# EAGLE board axiom_beta_sensor_cmv12000_tht_v0.16_r1.5c_jlcpcb (EAGLE 7.7.0), part 1 of 2
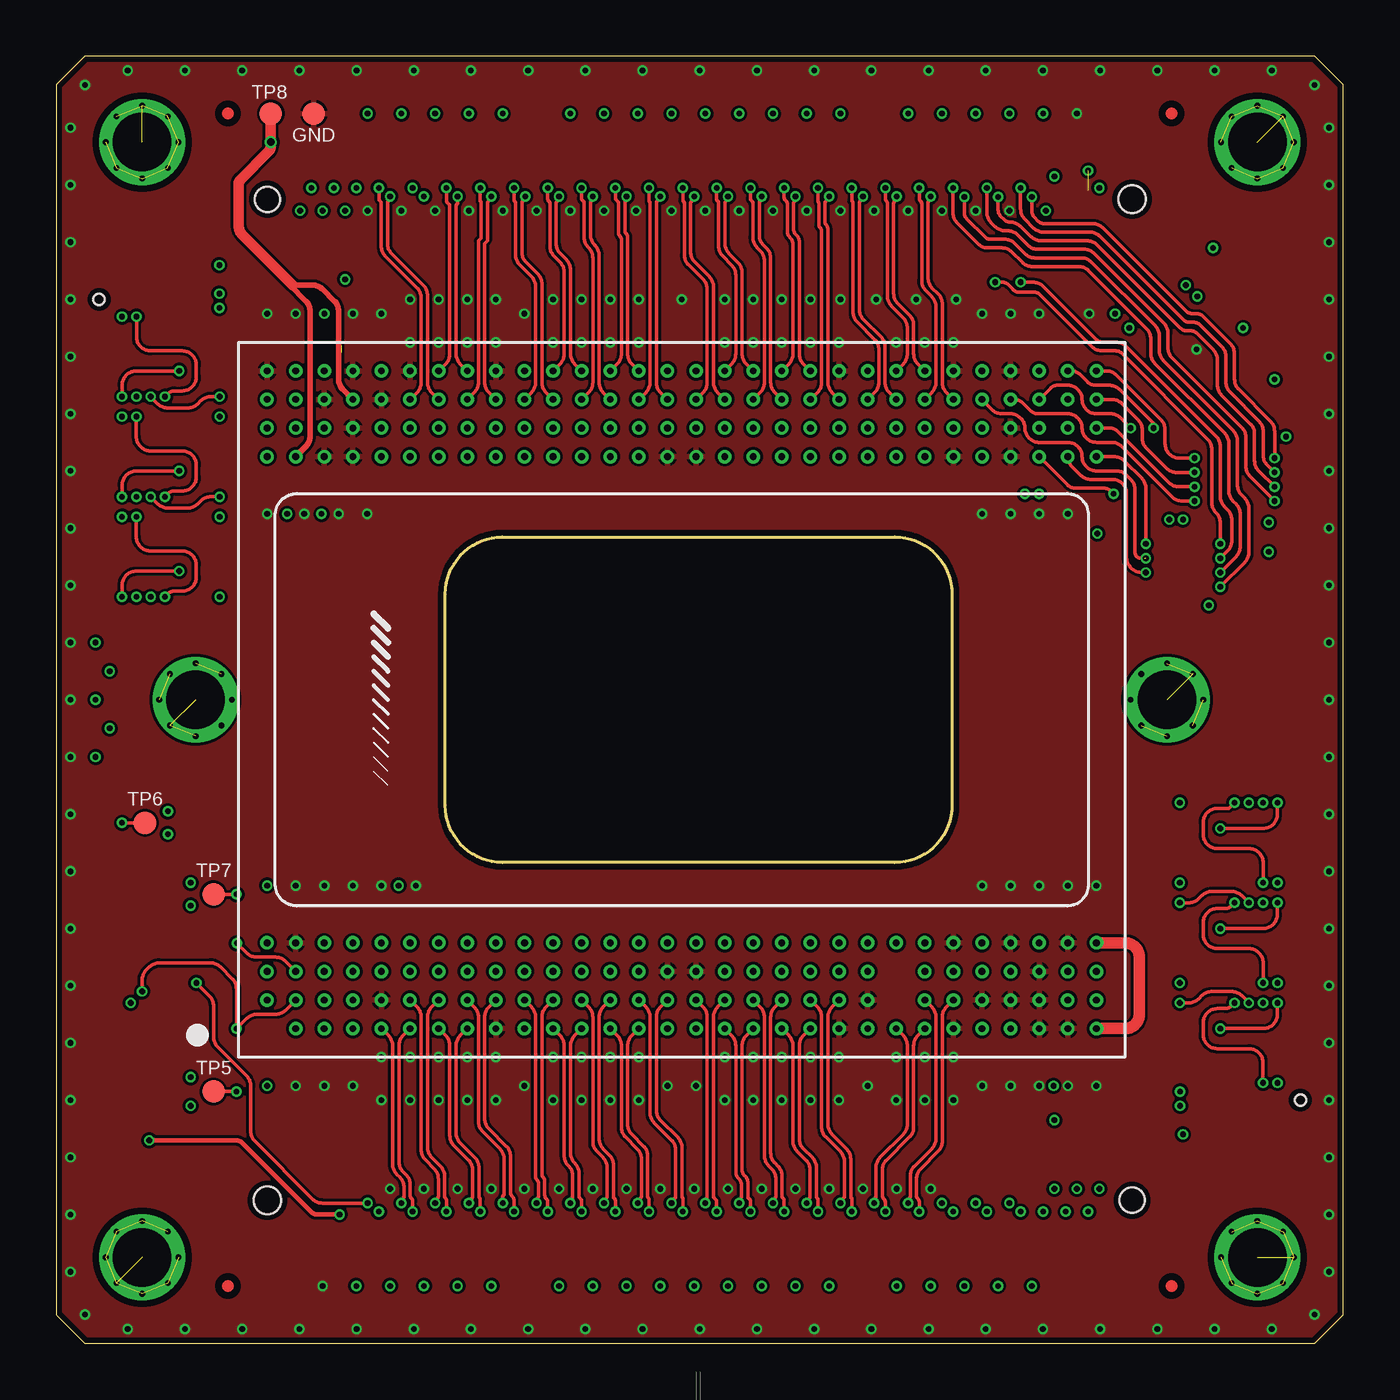
[diagram p5: board, top side]
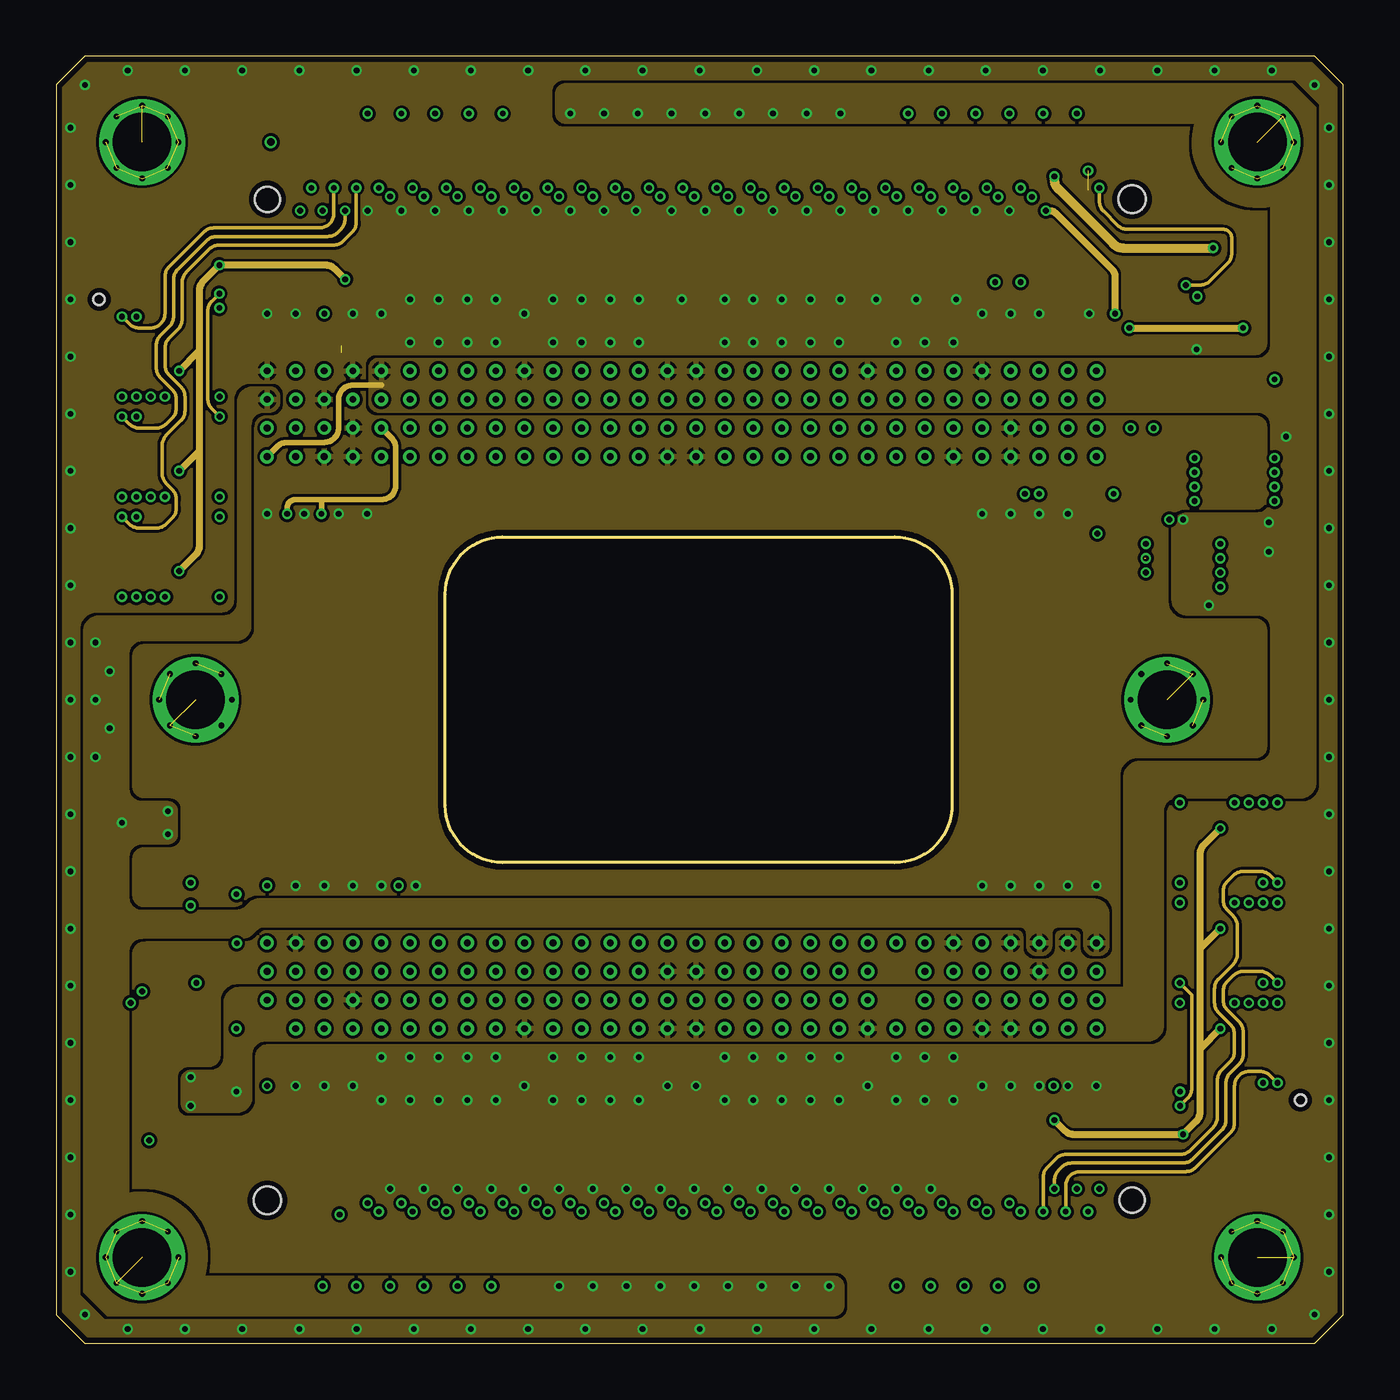
[diagram p6: board, inner layer Route2]
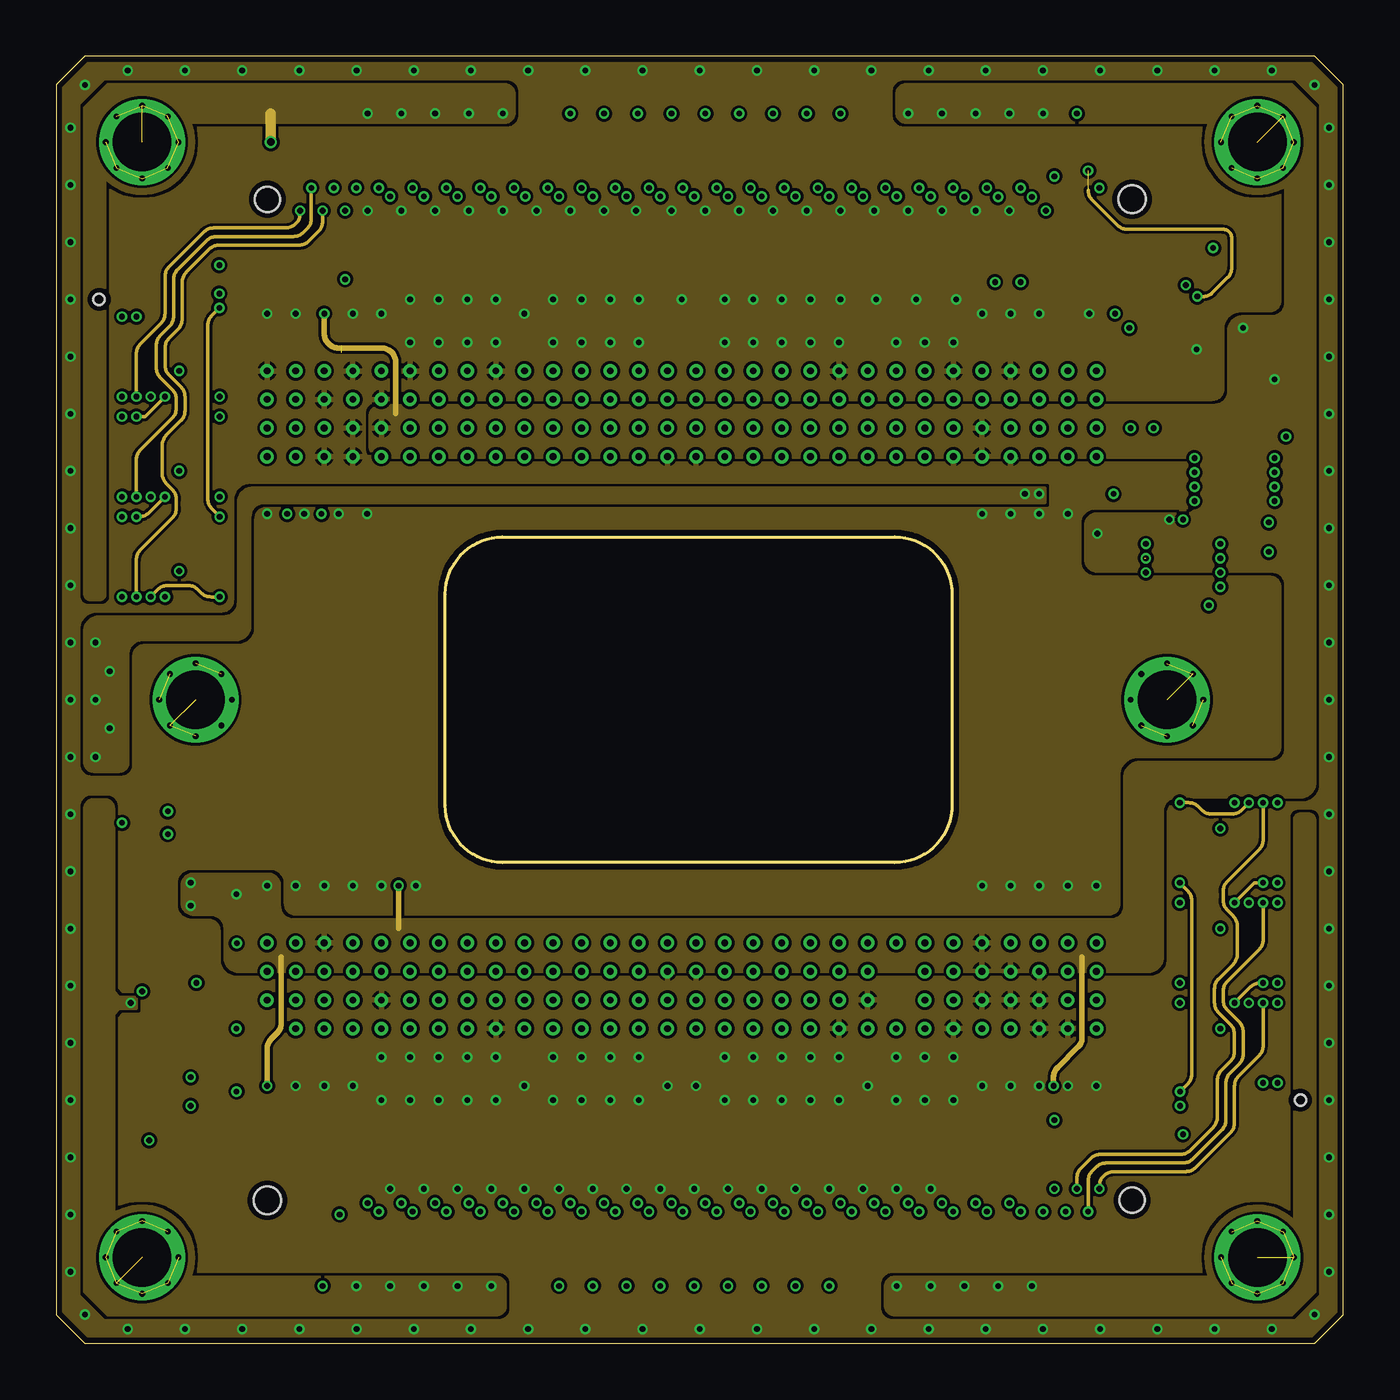
[diagram p7: board, inner layer Route15]
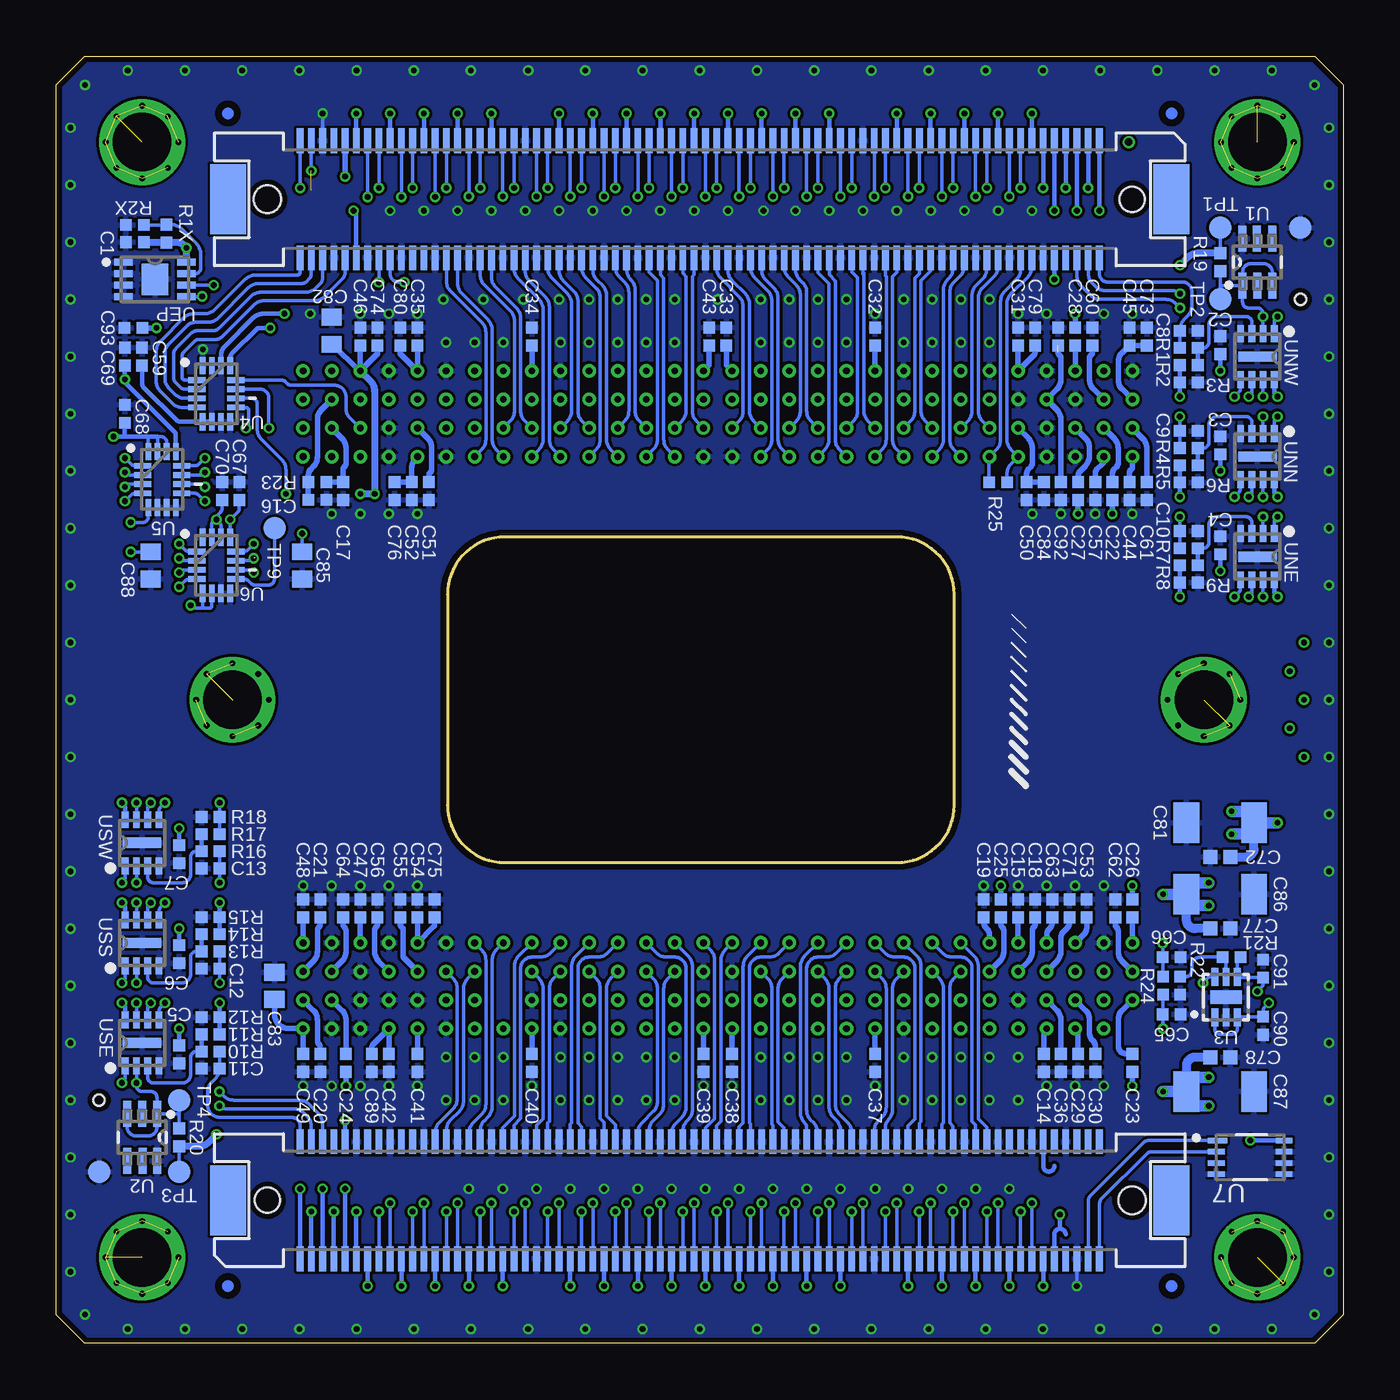
[diagram p8: board, bottom side, seen from below]

Size 57.15 x 57.15 mm. Coordinates in mm from the lower left corner, seen from the top.
Outline: 55.88,57.15 1.27,57.15 0,55.88 0,1.27 1.27,0 55.88,0 57.15,1.27 57.15,55.88 55.88,57.15
Outline: 37.23,21.34 19.81,21.34 arc-90 17.27,23.88 17.27,33.27 arc-90 19.81,35.8 37.23,35.8 arc-90 39.77,33.27 39.77,23.88 arc-90 37.23,21.34
Copper layers (1*2*15*16): Top 0.035559375mm / dielectric 0.17018125mm / Route2 0.01778125mm / dielectric 47mil / Route15 0.01778125mm / dielectric 0.17018125mm / Bottom 0.035559375mm
Design rules "axiom_beta_interface_OSHPark-4layer-tuned *": minimum track width 5mil, minimum drill 10mil, track to track 5mil, track to pad 5mil, pad to pad 5mil, via to via 5mil, smd to smd 5mil, copper to edge 10mil, drill to drill 6mil, minimum pad ring 4mil, minimum via ring 4mil, stop-mask expansion 2mil, vias tented up to drill 15mil, thermal gap 5mil
Net classes: 0 default: width 0.152 mm, drill 0.254 mm; 1 power: width 0.152 mm, drill 0.254 mm
Holes 0.5 mm at 55.25,10.79 1.9,46.36
bKeepout: area 1.4,24.8 to 13.4,32.4; area 43.9,24.8 to 56,32.4; area 50.8,50.8 to 55.9,55.9; area 50.8,1.3 to 55.9,6.3; area 1.3,1.3 to 6.3,6.3; area 1.3,50.8 to 6.3,55.9
tRestrict: area 51.1,1.6 to 55.5,6; area 1.6,51.1 to 6,55.5; area 51.1,51.1 to 55.5,55.5; area 1.6,1.6 to 6,6
bRestrict: area 48.9,41.7 to 49.5,41.8; area 48.9,42.1 to 49.5,42.2; area 54.4,43 to 54.5,44.1; area 53.7,43 to 53.8,44.1

## Footprints (pad centres in the part's own frame; a part is rotated, then mirrored left to right if it is on the bottom)
0402-C = smd 0.52 x 0.52: 1 -0.4,0; 2 0.4,0
0402-B = smd 0.62 x 0.62: 1 -0.45,0; 2 0.45,0
1206-B = smd 1.15 x 1.8: 1 -1.5,0; 2 1.5,0
0603-C = smd 0.75 x 0.9: 1 -0.6,0; 2 0.6,0
TP10R = smd 1 x 1: TP 0,0
10-30-07-237-400T4-JLCPCB = drill 0.3 pad 0.6: A2 -17.945,-14.605; A3 -16.675,-14.605; A4 -15.405,-14.605; A5 -14.135,-14.605; A6 -12.865,-14.605; A7 -11.595,-14.605; A8 -10.325,-14.605; A9 -9.055,-14.605; A10 -7.785,-14.605; A11 -6.515,-14.605; A12 -5.245,-14.605; A13 -3.975,-14.605; A14 -2.705,-14.605; A15 -1.435,-14.605; A16 -0.165,-14.605; A17 1.105,-14.605; A18 2.375,-14.605; A19 3.645,-14.605; A20 4.915,-14.605; A21 6.185,-14.605; A22 7.455,-14.605; A23 8.725,-14.605; A24 9.995,-14.605; A25 11.265,-14.605; A26 12.535,-14.605; A27 13.805,-14.605; A28 15.075,-14.605; A29 16.345,-14.605; A30 17.615,-14.605; B1 -19.215,-13.335; B2 -17.945,-13.335; B3 -16.675,-13.335; B4 -15.405,-13.335; B5 -14.135,-13.335; B6 -12.865,-13.335; B7 -11.595,-13.335; B8 -10.325,-13.335; B9 -9.055,-13.335; B10 -7.785,-13.335; B11 -6.515,-13.335; B12 -5.245,-13.335; B13 -3.975,-13.335; B14 -2.705,-13.335; B15 -1.435,-13.335; B16 -0.165,-13.335; B17 1.105,-13.335; B18 2.375,-13.335; B19 3.645,-13.335; B20 4.915,-13.335; B21 6.185,-13.335; B22 7.455,-13.335; B24 9.995,-13.335; B25 11.265,-13.335; B26 12.535,-13.335; B27 13.805,-13.335; B28 15.075,-13.335; B29 16.345,-13.335; B30 17.615,-13.335; C1 -19.215,-12.065; C2 -17.945,-12.065; C3 -16.675,-12.065; C4 -15.405,-12.065; C5 -14.135,-12.065; C6 -12.865,-12.065; C7 -11.595,-12.065; C8 -10.325,-12.065; C9 -9.055,-12.065; C10 -7.785,-12.065; C11 -6.515,-12.065; C12 -5.245,-12.065; C13 -3.975,-12.065; C14 -2.705,-12.065; C15 -1.435,-12.065; C16 -0.165,-12.065; C17 1.105,-12.065; C18 2.375,-12.065; C19 3.645,-12.065; C20 4.915,-12.065; C21 6.185,-12.065; C22 7.455,-12.065; C24 9.995,-12.065; C25 11.265,-12.065; C26 12.535,-12.065; C27 13.805,-12.065; C28 15.075,-12.065; C29 16.345,-12.065; C30 17.615,-12.065; D1 -19.215,-10.795; D2 -17.945,-10.795; D3 -16.675,-10.795; D4 -15.405,-10.795; D5 -14.135,-10.795; D6 -12.865,-10.795; D7 -11.595,-10.795; D8 -10.325,-10.795; D9 -9.055,-10.795; D10 -7.785,-10.795; D11 -6.515,-10.795; D12 -5.245,-10.795; D13 -3.975,-10.795; D14 -2.705,-10.795; D15 -1.435,-10.795; D16 -0.165,-10.795; D17 1.105,-10.795; D18 2.375,-10.795; D19 3.645,-10.795; D20 4.915,-10.795; D21 6.185,-10.795; D22 7.455,-10.795; D23 8.725,-10.795; D24 9.995,-10.795; D25 11.265,-10.795; D26 12.535,-10.795; D27 13.805,-10.795; D28 15.075,-10.795; D29 16.345,-10.795; D30 17.615,-10.795; E1 -19.215,10.795; E2 -17.945,10.795; E3 -16.675,10.795; E4 -15.405,10.795; E5 -14.135,10.795; E6 -12.865,10.795; E7 -11.595,10.795; E8 -10.325,10.795; E9 -9.055,10.795; E10 -7.785,10.795; E11 -6.515,10.795; E12 -5.245,10.795; E13 -3.975,10.795; E14 -2.705,10.795; E15 -1.435,10.795; E16 -0.165,10.795; E17 1.105,10.795; E18 2.375,10.795; E19 3.645,10.795; E20 4.915,10.795; E21 6.185,10.795; E22 7.455,10.795; E23 8.725,10.795; E24 9.995,10.795; E25 11.265,10.795; E26 12.535,10.795; E27 13.805,10.795; E28 15.075,10.795; E29 16.345,10.795; E30 17.615,10.795; F1 -19.215,12.065; F2 -17.945,12.065; F3 -16.675,12.065; F4 -15.405,12.065; F5 -14.135,12.065; F6 -12.865,12.065; F7 -11.595,12.065; F8 -10.325,12.065; F9 -9.055,12.065; F10 -7.785,12.065; F11 -6.515,12.065; F12 -5.245,12.065; F13 -3.975,12.065; F14 -2.705,12.065; F15 -1.435,12.065; F16 -0.165,12.065; F17 1.105,12.065; F18 2.375,12.065; F19 3.645,12.065; F20 4.915,12.065; F21 6.185,12.065; F22 7.455,12.065; F23 8.725,12.065; F24 9.995,12.065; F25 11.265,12.065; F26 12.535,12.065; F27 13.805,12.065; F28 15.075,12.065; F29 16.345,12.065; F30 17.615,12.065; G1 -19.215,13.335; G2 -17.945,13.335; G3 -16.675,13.335; G4 -15.405,13.335; G5 -14.135,13.335; G6 -12.865,13.335; G7 -11.595,13.335; G8 -10.325,13.335; G9 -9.055,13.335; G10 -7.785,13.335; G11 -6.515,13.335; G12 -5.245,13.335; G13 -3.975,13.335; G14 -2.705,13.335; G15 -1.435,13.335; G16 -0.165,13.335; G17 1.105,13.335; G18 2.375,13.335; G19 3.645,13.335; G20 4.915,13.335; G21 6.185,13.335; G22 7.455,13.335; G23 8.725,13.335; G24 9.995,13.335; G25 11.265,13.335; G26 12.535,13.335; G27 13.805,13.335; G28 15.075,13.335; G29 16.345,13.335; G30 17.615,13.335; H1 -19.215,14.605; H2 -17.945,14.605; H3 -16.675,14.605; H4 -15.405,14.605; H5 -14.135,14.605; H6 -12.865,14.605; H7 -11.595,14.605; H8 -10.325,14.605; H9 -9.055,14.605; H10 -7.785,14.605; H11 -6.515,14.605; H12 -5.245,14.605; H13 -3.975,14.605; H14 -2.705,14.605; H15 -1.435,14.605; H16 -0.165,14.605; H17 1.105,14.605; H18 2.375,14.605; H19 3.645,14.605; H20 4.915,14.605; H21 6.185,14.605; H22 7.455,14.605; H23 8.725,14.605; H24 9.995,14.605; H25 11.265,14.605; H26 12.535,14.605; H27 13.805,14.605; H28 15.075,14.605; H29 16.345,14.605; H30 17.615,14.605
SOT65P210X110-6N = smd 1.168 x 0.356: 1 -1.041,0.66; 2 -1.041,0; 3 -1.041,-0.66; 4 1.041,-0.66; 5 1.041,0.025; 6 1.041,0.66
MLF-6 = smd 0.3 x 0.8: 1 -0.5,-0.9; 2 0,-0.9; 3 0.5,-0.9; 4 0.5,0.9; 5 0,0.9; 6 -0.5,0.9 | smd 1.4 x 0.6: EP 0,0
QFN40P185X265X55-16N = smd 0.762 x 0.254: 1 -0.864,0.61; 2 -0.864,0.203; 3 -0.864,-0.203; 4 -0.864,-0.61; 9 0.864,-0.61; 10 0.864,-0.203; 11 0.864,0.203; 12 0.864,0.61 | smd 0.254 x 0.762: 5 -0.61,-1.245; 6 -0.203,-1.245; 7 0.203,-1.245; 8 0.61,-1.245; 13 0.61,1.245; 14 0.203,1.245; 15 -0.203,1.245; 16 -0.61,1.245
SOT996-2/3 = smd 0.25 x 0.85: 1 -0.75,-1.45 | smd 0.25 x 0.75: 2 -0.25,-1.5; 3 0.25,-1.5; 4 0.75,-1.5; 5 0.75,1.5; 6 0.25,1.5; 7 -0.25,1.5; 8 -0.75,1.5
DFN200X300X100-9N = smd 0.813 x 0.305: 1 -1.397,0.762; 2 -1.397,0.254; 3 -1.397,-0.254; 4 -1.397,-0.762; 5 1.397,-0.762; 6 1.397,-0.254; 7 1.397,0.254; 8 1.397,0.762 | smd 1.194 x 1.397: EP 0,0
DFN200X200X100-9N = smd 0.75 x 0.3: 1 -1.025,0.75; 2 -1.025,0.25; 3 -1.025,-0.25; 4 -1.025,-0.75; 5 1.025,-0.75; 6 1.025,-0.25; 7 1.025,0.25; 8 1.025,0.75 | smd 0.45 x 1.7: EP 0,0
FX10A-144P = smd 0.3 x 1.1: 1 -17.75,-2.6; 2 -17.75,2.6; 3 -17.25,-2.6; 4 -17.25,2.6; 5 -16.75,-2.6; 6 -16.75,2.6; 7 -16.25,-2.6; 8 -16.25,2.6; 9 -15.75,-2.6; 10 -15.75,2.6; 11 -15.25,-2.6; 12 -15.25,2.6; 13 -14.75,-2.6; 14 -14.75,2.6; 15 -14.25,-2.6; 16 -14.25,2.6; 17 -13.75,-2.6; 18 -13.75,2.6; 19 -13.25,-2.6; 20 -13.25,2.6; 21 -12.75,-2.6; 22 -12.75,2.6; 23 -12.25,-2.6; 24 -12.25,2.6; 25 -11.75,-2.6; 26 -11.75,2.6; 27 -11.25,-2.6; 28 -11.25,2.6; 29 -10.75,-2.6; 30 -10.75,2.6; 31 -10.25,-2.6; 32 -10.25,2.6; 33 -9.75,-2.6; 34 -9.75,2.6; 35 -9.25,-2.6; 36 -9.25,2.6; 37 -8.75,-2.6; 38 -8.75,2.6; 39 -8.25,-2.6; 40 -8.25,2.6; 41 -7.75,-2.6; 42 -7.75,2.6; 43 -7.25,-2.6; 44 -7.25,2.6; 45 -6.75,-2.6; 46 -6.75,2.6; 47 -6.25,-2.6; 48 -6.25,2.6; 49 -5.75,-2.6; 50 -5.75,2.6; 51 -5.25,-2.6; 52 -5.25,2.6; 53 -4.75,-2.6; 54 -4.75,2.6; 55 -4.25,-2.6; 56 -4.25,2.6; 57 -3.75,-2.6; 58 -3.75,2.6; 59 -3.25,-2.6; 60 -3.25,2.6; 61 -2.75,-2.6; 62 -2.75,2.6; 63 -2.25,-2.6; 64 -2.25,2.6; 65 -1.75,-2.6; 66 -1.75,2.6; 67 -1.25,-2.6; 68 -1.25,2.6; 69 -0.75,-2.6; 70 -0.75,2.6; 71 -0.25,-2.6; 72 -0.25,2.6; 73 0.25,-2.6; 74 0.25,2.6; 75 0.75,-2.6; 76 0.75,2.6; 77 1.25,-2.6; 78 1.25,2.6; 79 1.75,-2.6; 80 1.75,2.6; 81 2.25,-2.6; 82 2.25,2.6; 83 2.75,-2.6; 84 2.75,2.6; 85 3.25,-2.6; 86 3.25,2.6; 87 3.75,-2.6; 88 3.75,2.6; 89 4.25,-2.6; 90 4.25,2.6; 91 4.75,-2.6; 92 4.75,2.6; 93 5.25,-2.6; 94 5.25,2.6; 95 5.75,-2.6; 96 5.75,2.6; 97 6.25,-2.6; 98 6.25,2.6; 99 6.75,-2.6; 100 6.75,2.6; 101 7.25,-2.6; 102 7.25,2.6; 103 7.75,-2.6; 104 7.75,2.6; 105 8.25,-2.6; 106 8.25,2.6; 107 8.75,-2.6; 108 8.75,2.6; 109 9.25,-2.6; 110 9.25,2.6; 111 9.75,-2.6; 112 9.75,2.6; 113 10.25,-2.6; 114 10.25,2.6; 115 10.75,-2.6; 116 10.75,2.6; 117 11.25,-2.6; 118 11.25,2.6; 119 11.75,-2.6; 120 11.75,2.6; 121 12.25,-2.6; 122 12.25,2.6; 123 12.75,-2.6; 124 12.75,2.6; 125 13.25,-2.6; 126 13.25,2.6; 127 13.75,-2.6; 128 13.75,2.6; 129 14.25,-2.6; 130 14.25,2.6; 131 14.75,-2.6; 132 14.75,2.6; 133 15.25,-2.6; 134 15.25,2.6; 135 15.75,-2.6; 136 15.75,2.6; 137 16.25,-2.6; 138 16.25,2.6; 139 16.75,-2.6; 140 16.75,2.6; 141 17.25,-2.6; 142 17.25,2.6; 143 17.75,-2.6; 144 17.75,2.6 | smd 1.6 x 3.1: M1 -20.95,0; M2 20.95,0 | hole 1.125: -19.2,0 | hole 1.225: 19.2,0

## Placement (x,y rotation side)
C1  100n  [0402-C]  53.66,48.89 180 bottom
C2  100n  [0402-C]  5.46,44.32 90 bottom
C3  100n  [0402-C]  5.46,39.88 90 bottom
C4  100n  [0402-C]  5.46,35.43 90 bottom
C5  100n  [0402-C]  51.69,12.83 270 bottom
C6  100n  [0402-C]  51.69,17.27 270 bottom
C7  100n  [0402-C]  51.69,21.72 270 bottom
C8  1µ  [0402-C]  6.86,44.96 0 bottom
C9  1µ  [0402-C]  6.86,40.51 0 bottom
C10  1µ  [0402-C]  6.86,36.07 0 bottom
C11  1µ  [0402-C]  50.29,12.19 180 bottom
C12  1µ  [0402-C]  50.29,16.64 180 bottom
C13  1µ  [0402-C]  50.29,21.08 180 bottom
C14  100n  [0402-C]  13.3,12.45 270 bottom
C15  100n  [0402-C]  14.44,19.3 90 bottom
C16  100n  [0402-C]  45.55,37.45 0 bottom
C17  100n  [0402-C]  44.41,37.85 270 bottom
C18  100n  [0402-C]  13.68,19.3 90 bottom
C19  100n  [0402-C]  15.96,19.3 90 bottom
C20  100n  [0402-C]  45.43,12.45 270 bottom
C21  100n  [0402-C]  45.43,19.3 90 bottom
C22  100n  [0402-C]  10.25,37.85 90 bottom
C23  100n  [0402-C]  9.36,12.45 90 bottom
C24  100n  [0402-C]  44.28,12.45 90 bottom
C25  100n  [0402-C]  15.2,19.3 270 bottom
C26  100n  [0402-C]  9.36,19.3 270 bottom
C27  100n  [0402-C]  11.77,37.85 90 bottom
C28  100n  [0402-C]  11.9,44.7 270 bottom
C29  100n  [0402-C]  11.77,12.45 270 bottom
C30  100n  [0402-C]  11.01,12.45 270 bottom
C31  100n  [0402-C]  14.44,44.7 90 bottom
C32  100n  [0402-C]  20.79,44.7 90 bottom
C33  100n  [0402-C]  27.39,44.7 90 bottom
C34  100n  [0402-C]  36.03,44.7 90 bottom
C35  100n  [0402-C]  41.11,44.7 90 bottom
C36  100n  [0402-C]  12.54,12.45 270 bottom
C37  100n  [0402-C]  20.79,12.45 270 bottom
C38  100n  [0402-C]  27.14,12.45 270 bottom
C39  100n  [0402-C]  28.41,12.45 270 bottom
C40  100n  [0402-C]  36.03,12.45 270 bottom
C41  100n  [0402-C]  41.11,12.45 270 bottom
C42  100n  [0402-C]  42.38,12.45 270 bottom
C43  100n  [0402-C]  28.16,44.7 90 bottom
C44  100n  [0402-C]  9.49,37.85 270 bottom
C45  100n  [0402-C]  9.49,44.7 90 bottom
C46  100n  [0402-C]  43.65,44.7 90 bottom
C47  100n  [0402-C]  43.65,19.3 90 bottom
C48  100n  [0402-C]  46.19,19.3 90 bottom
C49  100n  [0402-C]  46.19,12.45 270 bottom
C50  100n  [0402-C]  14.06,37.85 270 bottom
C51  100n  [0402-C]  40.6,37.85 270 bottom
C52  100n  [0402-C]  41.36,37.85 270 bottom
C53  100n  [0402-C]  11.39,19.3 90 bottom
C54  100n  [0402-C]  41.11,19.3 90 bottom
C55  100n  [0402-C]  41.87,19.3 90 bottom
C56  100n  [0402-C]  42.89,19.3 90 bottom
C57  100n  [0402-C]  11.01,37.85 270 bottom
C58  100n  [0402-C]  12.66,44.7 90 bottom
C59  100n  [0402-C]  53.34,43.81 90 bottom
C60  100n  [0402-C]  11.14,44.7 90 bottom
C61  100n  [0402-C]  8.72,37.85 270 bottom
C62  100n  [0402-C]  10.12,19.3 90 bottom
C63  100n  [0402-C]  12.92,19.3 90 bottom
C64  100n  [0402-C]  44.41,19.3 90 bottom
C65  100n  [0402-C]  7.62,14.6 0 bottom
C66  100n  [0402-C]  7.62,17.14 0 bottom
C67  100n  [0402-C]  49.02,37.85 90 bottom
C68  100n  [0402-C]  54.1,41.27 90 bottom
C69  100n  [0402-C]  54.1,43.81 90 bottom
C70  100n  [0402-C]  49.78,37.85 90 bottom
C71  100n  [0402-C]  12.15,19.3 90 bottom
C72  4µ7  [0402-B]  5.46,21.59 180 bottom
C73  4µ7  [0402-C]  8.72,44.7 90 bottom
C74  4µ7  [0402-C]  42.89,44.7 90 bottom
C75  4µ7  [0402-C]  40.35,19.3 90 bottom
C76  4µ7  [0402-C]  42.13,37.85 270 bottom
C77  4µ7  [0402-B]  5.46,18.41 0 bottom
C78  4µ7  [0402-B]  5.46,12.7 0 bottom
C79  4µ7  [0402-C]  13.68,44.7 90 bottom
C80  4µ7  [0402-C]  41.87,44.7 90 bottom
C81  100µ  [1206-B]  5.46,23.11 180 bottom
C82  10µ  [0603-C]  44.92,44.96 90 bottom
C83  10µ  [0603-C]  47.46,15.88 90 bottom
C84  4µ7  [0402-C]  13.3,37.85 270 bottom
C85  10µ  [0603-C]  46.23,34.54 270 bottom
C86  100µ  [1206-B]  5.46,19.94 0 bottom
C87  100µ  [1206-B]  5.46,11.18 0 bottom
C88  10µ  [0603-C]  52.96,34.54 270 bottom
C89  4µ7  [0402-C]  43.14,12.45 270 bottom
C90  4µ7  [0402-C]  3.56,14.1 270 bottom
C91  4µ7  [0402-C]  3.56,16.64 270 bottom
C92  4µ7  [0402-C]  12.54,37.85 270 bottom
C93  100n  [0402-C]  53.72,45.09 180 bottom
FID1  FIDUCIAL  [FID_ARROW]  7.62,54.61 0 top
FID2  FIDUCIAL  [FID_ARROW]  49.53,54.61 0 top
FID3  FIDUCIAL  [FID_ARROW]  49.53,2.54 0 top
FID4  FIDUCIAL  [FID_ARROW]  7.62,2.54 0 top
FID5  FIDUCIAL-3A  [FID_3ARROW]  7.62,54.61 270 bottom
FID6  FIDUCIAL-3A  [FID_3ARROW]  49.53,54.61 270 bottom
FID7  FIDUCIAL-3A  [FID_3ARROW]  49.53,2.54 90 bottom
FID8  FIDUCIAL-3A  [FID_3ARROW]  7.62,2.54 90 bottom
GND  TPTP10R  [TP10R]  11.43,54.61 0 top
GND75  TPTP10R  [TP10R]  1.9,49.53 180 bottom
GND77  TPTP10R  [TP10R]  55.25,7.62 180 bottom
PARALLELLA  [PARALLELLA-FRAME]  28.57,28.57 0 top
R1  28k7  [0402-C]  6.86,44.2 0 bottom
R1X  [0402-C]  52.26,49.28 90 bottom
R2  3k32  [0402-C]  6.86,43.43 180 bottom
R2X  [0402-C]  53.66,49.66 180 bottom
R3  16k9  [0402-C]  6.86,42.67 0 bottom
R4  15k4  [0402-C]  6.86,39.75 0 bottom
R5  3k09  [0402-C]  6.86,38.99 180 bottom
R6  30k9  [0402-C]  6.86,38.23 0 bottom
R7  28k7  [0402-C]  6.86,35.31 0 bottom
R8  3k32  [0402-C]  6.86,34.54 180 bottom
R9  16k9  [0402-C]  6.86,33.78 0 bottom
R10  [0402-C]  50.29,12.95 180 bottom
R11  [0402-C]  50.29,13.72 0 bottom
R12  [0402-C]  50.29,14.48 180 bottom
R13  22k6  [0402-C]  50.29,17.4 180 bottom
R14  9k53  [0402-C]  50.29,18.16 0 bottom
R15  16k9  [0402-C]  50.29,18.92 180 bottom
R16  18k7  [0402-C]  50.29,21.84 180 bottom
R17  13k3  [0402-C]  50.29,22.61 0 bottom
R18  16k9  [0402-C]  50.29,23.37 180 bottom
R19  18k  [0402-C]  5.46,48.01 270 bottom
R20  18k  [0402-C]  51.69,9.14 90 bottom
R21  5k9  [0402-C]  4.95,17.14 0 bottom
R22  14k3  [0402-C]  7.24,15.88 90 bottom
R23  0R  [0402-C]  45.55,38.24 0 bottom
R24  0R  [0402-C]  8,15.88 90 bottom
R25  100R  [0402-C]  15.33,38.23 180 bottom
SENSOR  CMV12000JLCPCB  [10-30-07-237-400T4-JLCPCB]  28.57,28.57 0 top
TP1  TPTP10R  [TP10R]  5.46,49.53 0 bottom
TP2  TPTP10R  [TP10R]  5.46,46.36 0 bottom
TP3  TPTP10R  [TP10R]  51.69,7.62 0 bottom
TP4  TPTP10R  [TP10R]  51.69,10.79 0 bottom
TP5  TPTP10R  [TP10R]  6.98,11.18 0 top
TP6  TPTP10R  [TP10R]  3.94,23.11 0 top
TP7  TPTP10R  [TP10R]  6.98,19.94 0 top
TP8  TPTP10R  [TP10R]  9.52,54.61 0 top
TP9  TPTP10R  [TP10R]  47.46,36.2 0 bottom
U1  TLV431DCK  [SOT65P210X110-6N]  3.81,48.01 90 bottom
U2  TLV431DCK  [SOT65P210X110-6N]  53.34,9.14 270 bottom
U3  MIC47050  [MLF-6]  5.21,15.37 0 bottom
U4  SN74AVC4T774RSV  [QFN40P185X265X55-16N]  50.04,42.16 0 bottom
U5  SN74AVC4T774RSV  [QFN40P185X265X55-16N]  52.45,38.35 0 bottom
U6  SN74AVC4T774RSV  [QFN40P185X265X55-16N]  50.04,34.54 0 bottom
U7  LM75BGD  [SOT996-2/3]  4.13,8.25 270 bottom
U$1  [µZ-FRAME]  28.57,28.57 0 top
UEP  BR24G04NUX  [DFN200X300X100-9N]  52.77,47.24 0 bottom
UNE  TS332IQ2T  [DFN200X200X100-9N]  3.81,34.92 270 bottom
UNN  TS332IQ2T  [DFN200X200X100-9N]  3.81,39.37 270 bottom
UNW  TS332IQ2T  [DFN200X200X100-9N]  3.81,43.81 270 bottom
USE  TS332IQ2T  [DFN200X200X100-9N]  53.34,13.33 90 bottom
USS  TS332IQ2T  [DFN200X200X100-9N]  53.34,17.78 90 bottom
USW  TS332IQ2T  [DFN200X200X100-9N]  53.34,22.23 90 bottom
X-NORTH  FX10-144P  [FX10A-144P]  28.57,50.8 180 bottom
X-SOUTH  FX10-144P  [FX10A-144P]  28.57,6.35 0 bottom

## Tracks (layer width: path | path; a pad name or v marks a point on that pad's centre or on a via)
CLK_IN  (via drill 0.25)
  Top 0.152: SENSOR.E30 46.98,39.37 arc-45 47.43,39.18 48.2,38.41 arc-45 48.39,37.96 v48.39,35.5
  Bottom 0.152: U6.12 48.86,35.15 arc-45 48.64,35.25 v48.39,35.5
FRAME_REQ  (via drill 0.25)
  Top 0.152: SENSOR.G30 46.88,41.91 arc-45 47.33,41.72 48.04,41.02 arc-45 48.22,40.57 48.22,40.2 arc45 48.41,39.76 49.31,38.86 arc45 49.75,38.67 v50.55,38.67
  Bottom 0.152: U5.11 50.79,38.56 arc-45 50.57,38.65 v50.55,38.67
GND  (via drill 0.25)
  Bottom 0.152: X-NORTH.139 v45.33,54.61 | X-SOUTH.139 v11.82,2.54
  other vias: 1.27,55.88 1.27,1.27 0.63,3.18 0.63,5.71 0.63,8.25 0.63,10.79 0.63,13.33 0.63,15.88 0.63,18.41 0.63,20.95 0.63,23.49 0.63,26.04 0.63,28.57 0.63,31.11 0.63,33.66 0.63,36.2 0.63,38.73 0.63,41.27 0.63,43.81 0.63,46.36 0.63,48.89 0.63,51.44 0.63,53.97 56.52,3.18 56.52,5.71 56.52,8.25 56.52,10.79 56.52,13.33 56.52,15.88 56.52,18.41 56.52,20.95 56.52,23.49 56.52,26.04 56.52,28.57 56.52,31.11 56.52,33.66 56.52,36.2 56.52,38.73 56.52,41.27 56.52,43.81 56.52,46.36 56.52,48.89 56.52,51.44 56.52,53.97 55.88,55.88 53.97,56.52 51.44,56.52 48.89,56.52 46.36,56.52 43.81,56.52 41.27,56.52 38.73,56.52 36.2,56.52 33.66,56.52 31.11,56.52 28.57,56.52 26.04,56.52 23.49,56.52 20.95,56.52 18.41,56.52 15.88,56.52 13.33,56.52 10.79,56.52 8.25,56.52 5.71,56.52 3.18,56.52 53.97,0.63 51.44,0.63 48.89,0.63 46.36,0.63 43.81,0.63 41.27,0.63 38.73,0.63 36.2,0.63 33.66,0.63 31.11,0.63 28.57,0.63 26.04,0.63 23.49,0.63 20.95,0.63 18.41,0.63 15.88,0.63 13.33,0.63 10.79,0.63 8.25,0.63 5.71,0.63 3.18,0.63 55.88,1.27 15.71,46.36 16.98,46.36 18.25,46.36 19.52,46.36 14.44,45.72 20.79,45.72 22.06,46.36 23.33,46.36 24.6,46.36 25.87,46.36 27.77,46.36 29.68,46.36 30.95,46.36 32.22,46.36 33.49,46.36 33.49,44.45 34.76,44.45 32.22,44.45 30.95,44.45 29.68,44.45 25.87,44.45 24.6,44.45 23.33,44.45 22.06,44.45 19.52,44.45 18.25,44.45 16.98,44.45 15.71,44.45 38.57,44.45 39.84,44.45 37.3,44.45 14.44,12.7 15.71,12.7 16.98,12.7 18.25,12.7 19.52,12.7 20.79,11.43 22.06,12.7 23.33,12.7 24.6,12.7 25.87,12.7 27.14,11.43 28.41,11.43 29.68,12.7 30.95,12.7 32.22,12.7 33.49,12.7 34.76,12.7 36.03,11.43 37.3,12.7 38.57,12.7 39.84,12.7 37.3,10.79 38.57,10.79 39.84,10.79 34.76,10.79 33.49,10.79 32.22,10.79 30.95,10.79 29.68,10.79 25.87,10.79 24.6,10.79 23.33,10.79 22.06,10.79 19.52,10.79 18.25,10.79 16.98,10.79 15.71,10.79 14.44,10.79 42.38,45.72 43.65,45.72 13.17,45.72 12.54,36.83 13.8,36.83 11.01,36.83 9.36,36.83 42.38,36.83 43.65,36.83 41.11,20.32 42.38,20.32 43.65,20.32 44.92,20.32 46.19,20.32 10.63,20.32 11.9,20.32 13.17,20.32 14.44,20.32 15.96,20.32 41.11,11.43 42.38,11.43 43.65,11.43 44.92,11.43 46.19,11.43 10.63,11.43 11.9,11.43 13.17,11.43 16.32,6.86 17.82,6.86 19.32,6.86 20.79,6.86 22.32,6.86 23.82,6.86 25.32,6.86 26.82,6.86 28.32,6.86 29.82,6.86 31.32,6.86 32.83,6.86 34.33,6.86 35.83,6.86 37.33,6.86 38.83,6.86 14.82,6.86 13.82,50.29 15.32,50.29 16.82,50.29 18.32,50.29 19.82,50.29 21.32,50.29 22.82,50.29 24.32,50.29 25.74,50.29 27.32,50.29 28.82,50.29 30.32,50.29 31.82,50.29 33.33,50.29 34.83,50.29 36.33,50.29 37.83,50.29 39.33,50.29 41.11,36.83 44.92,36.83 41.11,45.72 10.63,45.72 9.36,45.72 39.97,46.36 40.83,50.29 42.33,50.29 45.87,45.72 34.82,46.36 36.41,46.36 38.19,46.36 50.63,44.13
  pour Bottom (rank 3): 55.88,57.15 1.27,57.15 0,55.88 0,1.27 1.27,0 55.88,0 57.15,1.27 57.15,55.88
  pour Top: 55.88,57.15 1.27,57.15 0,55.88 0,1.27 1.27,0 55.88,0 57.15,1.27 57.15,55.88
  pour Route2 (rank 3): 55.88,57.15 1.27,57.15 0,55.88 0,1.27 1.27,0 55.88,0 57.15,1.27 57.15,55.88
  pour Route15 (rank 3): 55.88,57.15 1.27,57.15 0,55.88 0,1.27 1.27,0 55.88,0 57.15,1.27 57.15,55.88
GND3  (via drill 0.25 pad 0.25, 2.6 pad 3.81)  (8 unrouted)
  other vias: 53.34,53.34 53.34,54.96 54.96,53.34 53.34,51.72 51.72,53.34 54.48,54.48 54.48,52.2 52.2,52.2 52.2,54.48
GND4  (via drill 0.25 pad 0.25, 2.6 pad 3.81)  (8 unrouted)
  other vias: 53.34,3.81 53.34,5.43 54.96,3.81 53.34,2.19 51.72,3.81 54.48,4.95 54.48,2.67 52.2,2.67 52.2,4.95
GND5  (via drill 0.25 pad 0.25, 2.6 pad 3.81)  (8 unrouted)
  other vias: 3.81,3.81 3.81,5.43 5.43,3.81 3.81,2.19 2.19,3.81 4.95,4.95 4.95,2.67 2.67,2.67 2.67,4.95
GND6  (via drill 0.25 pad 0.25, 2.6 pad 3.81)  (8 unrouted)
  other vias: 3.81,53.34 3.81,54.96 5.43,53.34 3.81,51.72 2.19,53.34 4.95,54.48 4.95,52.2 2.67,52.2 2.67,54.48
N00_N
  Bottom 0.152: X-NORTH.16 14.32,47.69 arc45 14.51,47.24 15.03,46.73 arc-45 15.21,46.28 15.21,40.13 arc45 15.4,39.68 SENSOR.E6 15.73,39.35 R25.2
N00_P
  Bottom 0.152: X-NORTH.14 13.82,47.8 arc45 14.01,47.35 14.75,46.61 arc-45 14.93,46.16 14.93,40.13 arc-45 14.75,39.68 SENSOR.E5 14.74,39.07 arc-45 14.93,38.62 R25.1
N01_N  (via drill 0.25)
  Top 0.152: v14.82,50.93 14.82,50.84 arc-45 14.79,50.75 14.74,50.71 arc45 14.71,50.62 14.71,48.84 arc45 14.89,48.39 16.3,46.98 arc-45 16.48,46.53 16.48,42.67 arc45 16.67,42.22 SENSOR.G7
  Bottom 0.152: X-NORTH.17 v14.82,50.93
N01_P  (via drill 0.25)
  Top 0.152: v14.32,51.31 14.32,50.83 arc45 14.36,50.74 14.39,50.71 arc-45 14.43,50.62 14.43,48.72 arc45 14.61,48.27 16.02,46.86 arc-45 16.2,46.41 16.2,42.67 arc-45 16.02,42.22 SENSOR.G6
  Bottom 0.152: X-NORTH.15 v14.32,51.31
N02_N
  Bottom 0.152: X-NORTH.22 15.82,47.72 arc45 16.01,47.27 16.3,46.98 arc-45 16.48,46.53 16.48,41.4 arc45 16.67,40.95 SENSOR.F7
N02_P
  Bottom 0.152: X-NORTH.20 15.32,47.82 arc45 15.51,47.37 16.02,46.86 arc-45 16.2,46.41 16.2,41.4 arc-45 16.02,40.95 SENSOR.F6
N03_N  (via drill 0.25)
  Bottom 0.152: X-NORTH.23 v16.32,50.93
N03_P  (via drill 0.25)
  Bottom 0.152: X-NORTH.21 v15.82,51.31
N04_N
  Bottom 0.152: X-NORTH.28 17.32,47.74 arc45 17.51,47.29 17.57,47.23 arc-45 17.75,46.78 17.75,40.13 arc45 17.94,39.68 SENSOR.E8
N04_P
  Bottom 0.152: X-NORTH.26 16.82,47.84 arc45 17.01,47.4 17.29,47.12 arc-45 17.48,46.67 17.48,40.13 arc-45 17.29,39.68 SENSOR.E7
N05_N  (via drill 0.25)
  Top 0.152: v17.82,50.93 17.82,50.66 arc-45 17.79,50.58 arc45 17.75,50.49 17.75,43.94 arc45 17.94,43.49 SENSOR.H8
  Bottom 0.152: X-NORTH.29 v17.82,50.93
N05_P  (via drill 0.25)
  Top 0.152: v17.32,51.31 17.32,50.75 arc45 17.36,50.66 17.44,50.58 arc-45 17.48,50.49 17.48,43.94 arc-45 17.29,43.49 SENSOR.H7
  Bottom 0.152: X-NORTH.27 v17.32,51.31
N06_N
  Bottom 0.152: X-NORTH.34 18.82,47.5 19.02,47.3 19.02,41.4 arc45 19.21,40.95 SENSOR.F9
N06_P
  Bottom 0.152: X-NORTH.32 18.32,47.61 18.74,47.19 18.74,41.4 arc-45 18.56,40.95 SENSOR.F8
N07_N  (via drill 0.25)
  Top 0.152: v19.32,50.93 19.32,50.85 19.19,50.71 arc45 19.15,50.62 19.15,48.96 19.02,48.84 19.02,42.67 arc45 19.21,42.22 SENSOR.G9
  Bottom 0.152: X-NORTH.35 v19.32,50.93
N07_P  (via drill 0.25)
  Top 0.152: v18.82,51.31 18.82,50.73 arc45 18.84,50.71 arc-45 18.87,50.62 18.87,49.08 18.74,48.95 18.74,42.67 arc-45 18.56,42.22 SENSOR.G8
  Bottom 0.152: X-NORTH.33 v18.82,51.31
N08_N
  Bottom 0.152: X-NORTH.40 20.32,47.4 20.3,47.37 20.3,40.13 arc45 20.48,39.68 SENSOR.E10
N08_P
  Bottom 0.152: X-NORTH.38 19.82,47.56 20.02,47.37 20.02,40.13 arc-45 19.83,39.68 SENSOR.E9
N09_N  (via drill 0.25)
  Top 0.152: v20.82,50.93 20.82,50.82 20.71,50.71 arc45 20.68,50.62 20.68,48.45 arc45 20.86,48 21.38,47.49 arc-45 21.56,47.04 21.56,42.67 arc45 21.75,42.22 SENSOR.G11
  Bottom 0.152: X-NORTH.41 v20.82,50.93
N09_P  (via drill 0.25)
  Top 0.152: v20.32,51.31 20.32,50.79 arc45 20.36,50.71 arc-45 20.4,50.62 20.4,48.34 arc45 20.58,47.89 21.1,47.37 arc-45 21.29,46.92 21.29,42.67 arc-45 21.1,42.22 SENSOR.G10
  Bottom 0.152: X-NORTH.39 v20.32,51.31
N10_N
  Bottom 0.152: X-NORTH.46 21.82,47.57 21.56,47.31 21.56,41.4 arc45 21.75,40.95 SENSOR.F11
N10_P
  Bottom 0.152: X-NORTH.44 21.32,47.47 21.29,47.51 21.29,41.4 arc-45 21.1,40.95 SENSOR.F10
N11_N  (via drill 0.25)
  Top 0.152: v22.32,50.93 22.32,50.8 22.24,50.71 arc45 22.2,50.62 22.2,48.84 arc45 22.39,48.39 22.65,48.12 arc-45 22.84,47.67 22.84,43.94 arc45 23.02,43.49 SENSOR.H12
  Bottom 0.152: X-NORTH.47 v22.32,50.93
N11_P  (via drill 0.25)
  Top 0.152: v21.82,51.31 21.82,50.82 arc45 21.86,50.73 21.88,50.71 arc-45 21.92,50.62 21.92,48.72 arc45 22.11,48.27 22.37,48.01 arc-45 22.55,47.56 22.55,43.94 arc-45 22.37,43.49 SENSOR.H11
  Bottom 0.152: X-NORTH.45 v21.82,51.31
N12_N
  Bottom 0.152: X-NORTH.52 23.32,47.55 22.84,47.06 22.84,40.13 arc45 23.02,39.68 SENSOR.E12
N12_P
  Bottom 0.152: X-NORTH.50 22.82,47.45 22.55,47.17 22.55,40.13 arc-45 22.37,39.68 SENSOR.E11
N13_N  (via drill 0.25)
  Top 0.152: v23.82,50.93 23.82,50.77 23.76,50.71 arc45 23.72,50.62 23.72,49.22 arc45 23.91,48.77 23.92,48.76 arc-45 24.11,48.31 24.11,42.67 arc45 24.29,42.22 SENSOR.G13
  Bottom 0.152: X-NORTH.53 v23.82,50.93
N13_P  (via drill 0.25)
  Top 0.152: v23.32,51.31 23.32,50.84 arc45 23.36,50.75 23.41,50.71 arc-45 23.44,50.62 23.44,49.1 arc45 23.63,48.65 23.64,48.64 arc-45 23.82,48.19 23.82,42.67 arc-45 23.64,42.22 SENSOR.G12
  Bottom 0.152: X-NORTH.51 v23.32,51.31
N14_N
  Bottom 0.152: X-NORTH.58 24.82,47.79 arc-45 24.64,47.34 24.29,46.99 arc45 24.11,46.54 24.11,41.4 arc45 24.29,40.95 SENSOR.F13
N14_P
  Bottom 0.152: X-NORTH.56 24.32,47.68 arc-45 24.14,47.23 24.01,47.11 arc45 23.82,46.66 23.82,41.4 arc-45 23.64,40.95 SENSOR.F12
N15_N  (via drill 0.25)
  Top 0.152: v25.32,50.93 25.32,50.75 25.29,50.71 arc45 25.25,50.62 25.25,49.41 arc45 25.3,49.28 arc-45 25.38,49.1 25.38,43.94 arc45 25.56,43.49 SENSOR.H14
  Bottom 0.152: X-NORTH.59 v25.32,50.93
N15_P  (via drill 0.25)
  Top 0.152: v24.82,51.31 24.82,50.87 arc45 24.86,50.78 24.93,50.71 arc-45 24.97,50.62 24.97,49.32 arc45 25.04,49.14 arc-45 25.09,49.02 25.09,43.94 arc-45 24.91,43.49 SENSOR.H13
  Bottom 0.152: X-NORTH.57 v24.82,51.31
N16_N
  Bottom 0.152: X-NORTH.64 26.32,47.76 arc-45 26.14,47.31 25.56,46.74 arc45 25.38,46.29 25.38,40.13 arc45 25.56,39.68 SENSOR.E14
N16_P
  Bottom 0.152: X-NORTH.62 25.82,47.66 arc-45 25.64,47.21 25.28,46.85 arc45 25.09,46.4 25.09,40.13 arc-45 24.91,39.68 SENSOR.E13
N17_N  (via drill 0.25)
  Top 0.152: v26.82,50.93 26.82,50.85 26.68,50.71 arc45 26.64,50.62 26.64,42.67 arc45 26.83,42.22 SENSOR.G15
  Bottom 0.152: X-NORTH.65 v26.82,50.93
N17_P  (via drill 0.25)
  Top 0.152: v26.32,51.31 26.32,50.72 arc45 26.33,50.71 arc-45 26.36,50.62 26.36,42.67 arc-45 26.18,42.22 SENSOR.G14
  Bottom 0.152: X-NORTH.63 v26.32,51.31
N18_N
  Bottom 0.152: X-NORTH.70 27.82,47.74 arc-45 27.64,47.29 26.83,46.48 arc45 26.64,46.03 26.64,41.4 arc45 26.83,40.95 SENSOR.F15
N18_P
  Bottom 0.152: X-NORTH.68 27.32,47.64 arc-45 27.14,47.19 26.55,46.6 arc45 26.36,46.15 26.36,41.4 arc-45 26.18,40.95 SENSOR.F14
N19_N  (via drill 0.25)
  Top 0.152: v28.32,50.93 28.32,50.83 28.21,50.71 arc45 28.17,50.62 28.17,48.45 arc45 28.36,48 29,47.36 arc-45 29.18,46.91 29.18,42.67 arc45 29.37,42.22 SENSOR.G17
  Bottom 0.152: X-NORTH.71 v28.32,50.93
N19_P  (via drill 0.25)
  Top 0.152: v27.82,51.31 27.82,50.78 arc45 27.85,50.71 arc-45 27.89,50.62 27.89,48.34 arc45 28.07,47.89 28.72,47.25 arc-45 28.9,46.8 28.9,42.67 arc-45 28.72,42.22 SENSOR.G16
  Bottom 0.152: X-NORTH.69 v27.82,51.31
N20_N
  Bottom 0.152: X-NORTH.76 29.32,47.51 29.18,47.37 29.18,41.4 arc45 29.37,40.95 SENSOR.F17
N20_P
  Bottom 0.152: X-NORTH.74 28.82,47.45 28.9,47.37 28.9,41.4 arc-45 28.72,40.95 SENSOR.F16
N21_N  (via drill 0.25)
  Top 0.152: v29.82,50.93 29.82,50.8 29.73,50.71 arc45 29.69,50.62 29.69,48.84 arc45 29.88,48.39 30.27,48 arc-45 30.45,47.55 30.45,43.94 arc45 30.64,43.49 SENSOR.H18
  Bottom 0.152: X-NORTH.77 29.82,50.98 v29.82,50.93
N21_P  (via drill 0.25)
  Top 0.152: v29.32,51.31 29.32,50.81 arc45 29.36,50.72 29.38,50.71 arc-45 29.41,50.62 29.41,48.72 arc45 29.6,48.27 29.99,47.88 arc-45 30.18,47.43 30.18,43.94 arc-45 29.99,43.49 SENSOR.H17
  Bottom 0.152: X-NORTH.75 29.32,51.36 v29.32,51.31
N22_N
  Bottom 0.152: X-NORTH.82 30.82,47.56 30.45,47.19 30.45,40.13 arc45 30.64,39.68 SENSOR.E18
N22_P
  Bottom 0.152: X-NORTH.80 30.32,47.45 30.18,47.3 30.18,40.13 arc-45 29.99,39.68 SENSOR.E17
N23_N  (via drill 0.25)
  Top 0.152: v31.32,50.93 31.32,50.78 31.25,50.71 arc45 31.22,50.62 31.22,49.22 arc45 31.4,48.77 31.54,48.63 arc-45 31.72,48.18 31.72,42.67 arc45 31.91,42.22 SENSOR.G19
  Bottom 0.152: X-NORTH.83 31.32,50.98 v31.32,50.93
N23_P  (via drill 0.25)
  Top 0.152: v30.82,51.31 30.82,50.84 arc45 30.86,50.75 30.9,50.71 arc-45 30.94,50.62 30.94,49.1 arc45 31.12,48.65 31.26,48.52 arc-45 31.45,48.07 31.45,42.67 arc-45 31.26,42.22 SENSOR.G18
  Bottom 0.152: X-NORTH.81 30.82,51.36 v30.82,51.31
N24_N
  Bottom 0.152: X-NORTH.88 32.33,47.8 arc-45 32.14,47.35 31.91,47.12 arc45 31.72,46.67 31.72,41.4 arc45 31.91,40.95 SENSOR.F19
N24_P
  Bottom 0.152: X-NORTH.86 31.82,47.69 arc-45 31.64,47.24 31.63,47.23 arc45 31.45,46.78 31.45,41.4 arc-45 31.26,40.95 SENSOR.F18
N25_N  (via drill 0.25)
  Top 0.152: v32.83,50.93 32.83,50.76 32.78,50.71 arc45 32.74,50.62 32.74,49.49 arc45 32.85,49.22 32.88,49.19 arc-45 32.99,48.92 32.99,43.94 arc45 33.18,43.49 SENSOR.H20
  Bottom 0.152: X-NORTH.89 32.83,50.98 v32.83,50.93
N25_P  (via drill 0.25)
  Top 0.152: v32.33,51.31 32.33,50.86 arc45 32.36,50.77 32.42,50.71 arc-45 32.46,50.62 32.46,49.38 arc45 32.57,49.11 32.6,49.08 arc-45 32.71,48.81 32.71,43.94 arc-45 32.53,43.49 SENSOR.H19
  Bottom 0.152: X-NORTH.87 32.33,51.36 v32.33,51.31
N26_N
  Bottom 0.152: X-NORTH.94 33.83,47.77 arc-45 33.64,47.32 33.18,46.86 arc45 32.99,46.41 32.99,40.13 arc45 33.18,39.68 SENSOR.E20
N26_P
  Bottom 0.152: X-NORTH.92 33.33,47.67 arc-45 33.14,47.22 32.9,46.98 arc45 32.71,46.53 32.71,40.13 arc-45 32.53,39.68 SENSOR.E19
N27_N  (via drill 0.25)
  Top 0.152: v34.33,50.93 34.33,50.86 34.17,50.71 arc45 34.14,50.62 34.14,49.79 arc45 34.19,49.66 arc-45 34.27,49.48 34.27,42.67 arc45 34.45,42.22 SENSOR.G21
  Bottom 0.152: X-NORTH.95 34.33,50.98 v34.33,50.93
N27_P  (via drill 0.25)
  Top 0.152: v33.83,51.31 33.83,50.71 arc-45 33.86,50.63 33.86,49.67 arc45 33.91,49.55 arc-45 33.98,49.37 33.98,42.67 arc-45 33.8,42.22 SENSOR.G20
  Bottom 0.152: X-NORTH.93 33.83,51.36 v33.83,51.31
N28_N
  Bottom 0.152: X-NORTH.100 35.33,47.75 arc-45 35.14,47.3 34.45,46.61 arc45 34.27,46.16 34.27,41.4 arc45 34.45,40.95 SENSOR.F21
N28_P
  Bottom 0.152: X-NORTH.98 34.83,47.64 arc-45 34.64,47.19 34.17,46.73 arc45 33.98,46.28 33.98,41.4 arc-45 33.8,40.95 SENSOR.F20
N29_N  (via drill 0.25)
  Top 0.152: v35.83,50.93 35.83,50.89 arc-45 35.79,50.8 35.7,50.71 arc45 35.66,50.62 35.66,45.91 arc45 35.85,45.47 36.62,44.69 arc-45 36.8,44.24 36.8,42.67 arc45 36.99,42.22 SENSOR.G23
  Bottom 0.152: X-NORTH.101 35.83,50.98 v35.83,50.93
N29_P  (via drill 0.25)
  Top 0.152: v35.33,51.31 35.33,50.76 arc45 35.34,50.71 arc-45 35.38,50.62 35.38,45.8 arc45 35.57,45.35 36.34,44.58 arc-45 36.52,44.13 36.52,42.67 arc-45 36.34,42.22 SENSOR.G22
  Bottom 0.152: X-NORTH.99 35.33,51.36 v35.33,51.31
N30_N
  Bottom 0.152: X-NORTH.106 36.83,47.72 arc-45 36.64,47.27 35.72,46.36 arc45 35.53,45.91 35.53,40.13 arc45 35.72,39.68 SENSOR.E22
N30_P
  Bottom 0.152: X-NORTH.104 36.33,47.62 arc-45 36.14,47.17 35.44,46.47 arc45 35.25,46.02 35.25,40.13 arc-45 35.07,39.68 SENSOR.E21
N31_N  (via drill 0.25)
  Top 0.152: v37.33,50.93 37.33,50.81 37.22,50.71 arc45 37.19,50.62 37.19,46.61 arc45 37.37,46.16 37.89,45.65 arc-45 38.08,45.2 38.08,43.94 arc45 38.26,43.49 SENSOR.H24
  Bottom 0.152: X-NORTH.107 37.33,50.98 v37.33,50.93
N31_P  (via drill 0.25)
  Top 0.152: v36.83,51.31 36.83,50.81 arc45 36.86,50.72 36.87,50.71 arc-45 36.91,50.62 36.91,46.5 arc45 37.09,46.05 37.61,45.53 arc-45 37.8,45.08 37.8,43.94 arc-45 37.61,43.49 SENSOR.H23
  Bottom 0.152: X-NORTH.105 36.83,51.36 v36.83,51.31
N32_N
  Bottom 0.152: X-NORTH.112 38.33,47.45 arc-45 38.14,47 36.99,45.85 arc45 36.8,45.4 36.8,41.4 arc45 36.99,40.95 SENSOR.F23
N32_P
  Bottom 0.152: X-NORTH.110 37.83,47.34 arc-45 37.64,46.89 36.71,45.96 arc45 36.52,45.52 36.52,41.4 arc-45 36.34,40.95 SENSOR.F22
N33_N  (via drill 0.25)
  Top 0.152: v38.83,50.93 38.83,50.79 38.75,50.71 arc45 38.71,50.62 38.71,47.31 arc45 38.9,46.86 39.16,46.6 arc-45 39.34,46.15 39.34,42.67 arc45 39.53,42.22 SENSOR.G25
  Bottom 0.152: X-NORTH.113 38.83,50.98 v38.83,50.93
N33_P  (via drill 0.25)
  Top 0.152: v38.33,51.31 38.33,50.83 arc45 38.36,50.74 38.39,50.71 arc-45 38.43,50.62 38.43,47.2 arc45 38.62,46.75 38.88,46.48 arc-45 39.06,46.03 39.06,42.67 arc-45 38.88,42.22 SENSOR.G24
  Bottom 0.152: X-NORTH.111 38.33,51.36 v38.33,51.31
N34_N
  Bottom 0.152: X-NORTH.118 39.83,47.17 arc-45 39.64,46.72 38.26,45.34 arc45 38.08,44.89 38.08,40.13 arc45 38.26,39.68 SENSOR.E24
N34_P
  Bottom 0.152: X-NORTH.116 39.33,47.06 arc-45 39.14,46.61 37.98,45.46 arc45 37.8,45.01 37.8,40.13 arc-45 37.61,39.68 SENSOR.E23
N35_N  (via drill 0.25)
  Top 0.152: v51.69,33.59 52.77,34.68 arc45 52.96,35.12 52.96,37.08 arc45 52.77,37.52 52.64,37.66 arc-45 52.45,38.11 52.45,40.09 arc45 52.27,40.53 49.17,43.63 arc-45 48.98,44.08 48.98,44.73 arc45 48.8,45.18 45.97,48.01 arc45 45.52,48.2 43.47,48.2 arc-45 43.02,48.38 42.57,48.84 arc45 42.12,49.02 41.5,49.02 arc-45 41.23,49.13 40.44,49.93 arc-45 40.33,50.2 v40.33,50.9
  Bottom 0.152: U6.4 51.22,33.93 arc-45 51.44,33.84 v51.69,33.59 | X-NORTH.119 v40.33,50.9
N35_P  (via drill 0.25)
  Top 0.152: v39.83,51.31 39.83,50.19 arc45 40.01,49.74 40.92,48.83 arc45 41.37,48.64 41.99,48.64 arc-45 42.44,48.45 42.89,48 arc45 43.34,47.82 45.39,47.82 arc-45 45.84,47.63 48.42,45.05 arc-45 48.6,44.61 48.6,43.95 arc45 48.79,43.5 51.88,40.41 arc-45 52.07,39.96 52.07,37.85 arc45 52.26,37.41 52.39,37.27 arc-45 52.58,36.82 52.58,35.38 arc-45 52.39,34.93 v51.69,34.23
  Bottom 0.152: U6.3 51.44,34.34 arc-45 51.67,34.25 v51.69,34.23 | X-NORTH.117 v39.83,51.31
N37_N  (via drill 0.25)
  Top 0.152: v41.83,50.9 41.83,50.32 arc45 41.94,50.05 42.09,49.9 arc45 42.36,49.78 42.37,49.78 arc-45 42.82,49.6 43.27,49.14 arc45 43.72,48.96 45.77,48.96 arc-45 46.22,48.77 49.93,45.07 arc45 50.2,44.96 50.39,44.96 arc-45 50.66,44.85 51.38,44.13 arc-45 51.56,43.68 51.56,42.55 arc45 51.75,42.1 53.03,40.83 arc-45 53.21,40.38 53.21,39.19 arc45 53.4,38.74 v54.1,38.04
  Bottom 0.152: U5.3 53.86,38.15 arc-45 54.08,38.06 v54.1,38.04 | X-NORTH.125 v41.83,50.9
N37_P  (via drill 0.25)
  Top 0.152: v41.33,51.31 41.33,50.21 arc45 41.51,49.76 41.69,49.59 arc45 42.13,49.4 42.24,49.4 arc-45 42.69,49.22 43.15,48.76 arc45 43.6,48.58 45.65,48.58 arc-45 46.1,48.39 49.18,45.31 arc-45 49.36,44.86 49.36,44.2 arc45 49.55,43.76 52.65,40.66 arc-45 52.83,40.21 52.83,38.94 arc45 53.02,38.49 v54.1,37.4
  Bottom 0.152: U5.4 53.63,37.74 arc-45 53.85,37.65 v54.1,37.4 | X-NORTH.123 v41.33,51.31
N38_N  (via drill 0.25)
  Top 0.152: v42.83,47.12 43.38,47.12 arc-45 43.83,46.93 46.2,44.56 arc45 46.47,44.45 47.07,44.45 arc-45 47.52,44.26 51.5,40.28 arc-45 51.69,39.83 51.69,37.6 arc45 51.88,37.15 52.01,37.02 arc-45 52.2,36.57 52.2,35.63 arc-45 52.01,35.18 v51.69,34.86
  Bottom 0.152: U6.2 51.44,34.75 arc45 51.67,34.84 v51.69,34.86 | X-NORTH.130 v42.83,47.12
N38_P  (via drill 0.25)
  Top 0.152: v51.69,35.5 51.69,36.44 arc45 51.5,36.89 51.49,36.9 arc-45 51.31,37.35 51.31,39.7 arc45 51.12,40.15 47.32,43.96 arc45 47.05,44.07 46.45,44.07 arc-45 46,44.25 43.69,46.56 arc45 43.42,46.67 42.71,46.67 arc-45 42.47,46.81 42.28,47 arc45 42.01,47.12 v41.69,47.12
  Bottom 0.152: U6.1 51.22,35.15 arc45 51.44,35.25 v51.69,35.5 | X-NORTH.128 42.33,47.5 arc-90 41.94,47.12 v41.69,47.12
N39_N  (via drill 0.25)
  Top 0.152: v54.1,39.31 54.1,40.5 arc45 53.92,40.95 52.51,42.36 arc-45 52.32,42.81 | v43.33,50.9 43.33,50.27 arc45 43.44,50 43.6,49.83 arc45 43.87,49.72 46.03,49.72 arc-45 46.48,49.53 50.18,45.83 arc45 50.45,45.72 50.64,45.72 arc-45 50.91,45.61 52.14,44.38 arc-45 52.32,43.93 52.32,42.81 | 52.32,42.81
  Bottom 0.152: U5.1 53.63,38.96 arc45 53.85,39.06 v54.1,39.31 | X-NORTH.131 v43.33,50.9
N39_P  (via drill 0.25)
  Top 0.152: v42.83,51.31 42.83,50.36 arc45 43.01,49.91 43.4,49.52 arc45 43.85,49.34 45.9,49.34 arc-45 46.35,49.15 50.05,45.45 arc45 50.32,45.34 50.52,45.34 arc-45 50.78,45.23 51.76,44.25 arc-45 51.94,43.81 51.94,42.68 arc45 52.13,42.23 53.41,40.95 arc-45 53.59,40.5 53.59,39.44 arc45 53.78,38.99 v54.1,38.67
  Bottom 0.152: U5.2 53.86,38.56 arc45 54.08,38.65 v54.1,38.67 | X-NORTH.129 v42.83,51.31
N$1
  Bottom 0.152: UEP.7 50.99,47.5 arc-90 50.74,47.75 50.74,48.38 arc-45 50.92,48.83 51.59,49.49 arc-45 52.03,49.68 R1X.2 52.28,49.66 R2X.1
N$5
  Bottom 0.254: C60.1 11.14,43.99 arc45 11.18,43.91 11.23,43.85 arc-45 11.27,43.76 11.27,42.81 arc-45 11.08,42.36 SENSOR.G2
N$6
  Bottom 0.254: C61.1 8.72,39.74 arc-45 8.91,40.19 SENSOR.F1
N$8
  Bottom 0.152: U6.9 48.8,33.93 arc45 48.62,33.86 48.51,33.75 arc-45 48.33,33.67 47.71,33.67 arc-90 47.46,33.93 TP9.TP
N$11
  Bottom 0.254: C62.1 10.12,18.6 arc-45 10.07,18.47 arc45 10,18.29 10,17.41 arc-45 9.81,16.96 SENSOR.C1
N$12
  Bottom 0.254: C63.1 12.92,18.7 arc45 13.03,18.43 13.06,18.4 arc-45 13.17,18.13 SENSOR.D4
N$15
  Bottom 0.254: C64.1 44.41,18.59 arc-45 44.38,18.5 arc45 44.28,18.29 44.28,17.41 arc45 44.47,16.96 SENSOR.C29
N$16
  Bottom 0.254: C71.1 12.15,18.7 arc45 12.27,18.43 12.42,18.27 arc-45 12.54,18 12.54,17.41 arc45 12.72,16.96 SENSOR.C4
N$17
  Bottom 0.254: C14.1 13.3,13.68 arc45 SENSOR.A4
N$18
  Bottom 0.254: C15.1 SENSOR.D5
N$19
  Bottom 0.152: U3.5 5.21,17.13 R21.1 6.35,17.14 arc-90 6.73,16.76 6.73,16.53 arc90 6.98,16.27 R22.2
N$21
  Bottom 0.254: C18.1 13.68,18.62 arc45 13.73,18.49 arc-45 13.8,18.31 13.8,17.41 arc45 13.99,16.96 SENSOR.C5
N$22
  Bottom 0.254: C19.1 15.96,18.7 arc-45 15.85,18.43 15.82,18.4 arc45 15.71,18.13 SENSOR.D6
N$23
  Bottom 0.254: C20.1 45.43,13.15 arc-45 45.47,13.24 arc45 45.55,13.46 45.55,14.34 arc-45 45.74,14.79 SENSOR.B30
N$24
  Bottom 0.254: C21.1 45.43,18.59 arc45 45.47,18.5 arc-45 45.55,18.29 45.55,17.41 arc45 45.74,16.96 SENSOR.C30
N$25
  Bottom 0.254: C22.2 10.25,38.63 arc45 10.18,38.81 10.07,38.91 arc-45 10,39.09 10,39.74 arc-45 10.18,40.19 SENSOR.F2
N$26
  Bottom 0.254: C23.2 9.61,12.85 arc90 10,13.23 10,14.34 arc45 9.81,14.79 SENSOR.B1
N$27
  Bottom 0.254: C24.2 44.28,14.34 arc-45 44.47,14.79 SENSOR.B29
N$28
  Bottom 0.254: C25.2 15.2,18.62 arc-45 15.15,18.49 arc45 15.07,18.31 15.07,17.41 arc45 15.26,16.96 SENSOR.C6
N$29
  Bottom 0.254: C26.2 SENSOR.D1
N$30
  Bottom 0.254: C27.2 11.77,38.53 arc45 11.7,38.71 11.45,38.96 arc-45 11.27,39.51 11.27,39.74 arc-45 11.45,40.19 SENSOR.F3
N$31
  Bottom 0.254: C28.2 SENSOR.H3
N$32
  Bottom 0.254: C29.1 11.77,13.68 arc-45 SENSOR.A3
N$33
  Bottom 0.254: C30.1 11.01,13.18 arc-45 11.12,13.45 11.15,13.48 arc45 11.27,13.75 11.27,14.34 arc-45 11.45,14.79 SENSOR.B3
N$172  (via drill 0.25)
  Top 0.152: v49.89,15.11 50.28,15.11 arc45 50.73,15.3 50.87,15.43 arc-45 51.32,15.62 52.19,15.62 arc-45 52.64,15.43 v52.96,15.11
  Bottom 0.152: USE.6 53.09,14.88 arc45 53.02,15.06 v52.96,15.11
  Bottom 0.203: R11.2 R12.1 v49.89,15.11
N$173  (via drill 0.25)
  Top 0.152: v4.19,37.59 4.51,37.27 arc45 4.96,37.08 5.83,37.08 arc45 6.28,37.27 6.42,37.41 arc-45 6.87,37.59 v7.26,37.59
  Bottom 0.152: UNN.6 4.06,37.83 arc45 4.13,37.65 v4.19,37.59
  Bottom 0.203: R5.2 R6.1 v7.26,37.59
N$182  (via drill 0.25)
  Route15 0.152: v4.19,33.15 4.51,33.47 arc-45 4.96,33.66 5.83,33.66 arc-45 6.28,33.47 6.42,33.33 arc45 6.87,33.15 v7.26,33.15
  Bottom 0.152: UNE.6 4.06,33.38 arc45 4.13,33.2 v4.19,33.15
  Bottom 0.203: R8.2 R9.1 v7.26,33.15
N$183
  Bottom 0.152: USE.3 53.09,11.81 arc-90 52.84,11.56 51.56,11.56 arc-90 51.18,11.94 51.18,12.7 arc90 50.93,12.95 R10.2
  Bottom 0.203: R10.2 R11.1
N$188
  Bottom 0.152: UNE.3 4.06,36.45 arc-90 4.31,36.7 5.59,36.7 arc-90 5.97,36.32 5.97,35.56 arc90 6.22,35.31 R7.2
  Bottom 0.203: R8.1 R7.2
N$191
  Bottom 0.152: UNW.3 4.06,45.34 arc-90 4.31,45.59 5.59,45.59 arc-90 5.97,45.21 5.97,44.45 arc90 6.22,44.2 R1.2
  Bottom 0.203: R1.2 R2.1
N$192  (via drill 0.25)
  Top 0.152: v7.26,42.04 6.87,42.04 arc45 6.42,41.85 6.28,41.72 arc-45 5.83,41.53 4.96,41.53 arc-45 4.51,41.72 v4.19,42.04
  Bottom 0.152: UNW.6 4.06,42.17 v4.19,42.04
  Bottom 0.203: R2.2 R3.1 v7.26,42.04
N$193  (via drill 0.25)
  Top 0.152: v52.96,19.56 52.64,19.88 arc45 52.19,20.07 51.32,20.07 arc45 50.87,19.88 50.73,19.74 arc-45 50.28,19.56 v49.89,19.56
  Bottom 0.152: USS.6 53.09,19.32 arc45 53.02,19.5 v52.96,19.56
  Bottom 0.203: R14.2 R15.1 v49.89,19.56
N$194
  Bottom 0.152: USS.3 53.09,16.26 arc-90 52.84,16 51.56,16 arc-90 51.18,16.38 51.18,17.14 arc90 50.93,17.4 R13.2
  Bottom 0.203: R14.1 R13.2
N$195
  Bottom 0.152: USW.3 53.09,20.7 arc-90 52.84,20.45 51.56,20.45 arc-90 51.18,20.83 51.18,21.59 arc90 50.93,21.84 R16.2
  Bottom 0.203: R17.1 R16.2
N$196  (via drill 0.25)
  Route15 0.152: v52.96,24 52.64,23.68 arc-45 52.19,23.49 51.32,23.49 arc-45 50.87,23.68 50.73,23.82 arc45 50.28,24 v49.89,24
  Bottom 0.152: USW.6 53.09,23.77 arc45 53.02,23.95 v52.96,24 | R17.2 R18.1 v49.89,24
N_CHK_V  (via drill 0.25)
  Top 0.152: v5.46,43.18 3.56,43.18 arc90 2.92,42.55 v2.92,42.04 | v2.92,33.15 2.92,33.66 arc-90 3.56,34.29 v5.46,34.29 | v5.46,38.73 3.56,38.73 arc90 2.92,38.1 v2.92,37.59
  Route2 0.305: 6.35,44.07 6.35,46.73 arc-45 6.54,47.18 v7.24,47.88 11.98,47.88 arc-45 12.34,47.73 v12.82,47.24 | 6.35,44.07 6.35,39.62 | 6.35,39.62 6.35,35.44 arc-45 6.16,34.99 v5.46,34.29 | v5.46,38.73 6.35,39.62 | v5.46,43.18 6.35,44.07
  Bottom 0.152: R19.1 TP1.TP
  Bottom 0.203: UNW.8 3.06,42.18 v2.92,42.04 | UNE.8 3.06,33.39 arc-45 2.99,33.21 v2.92,33.15 | UNN.8 3.06,37.84 arc-45 2.99,37.66 v2.92,37.59 | C2.1 v5.46,43.18 | C3.1 v5.46,38.73 | C4.1 v5.46,34.29 | X-NORTH.10 v12.82,47.24
  Bottom 0.305: R19.1 6.45,48.41 arc-45 6.9,48.22 v7.24,47.88
N_I2C_V  (via drill 0.25)
  Route2 0.254: 44.33,51.81 v44.33,51.82
  Route2 0.406: v44.33,51.82 44.33,51.69 arc45 44.51,51.25 46.94,48.82 arc45 47.39,48.64 v51.37,48.64
  Bottom 0.152: 52.27,48.89 R1X.1
  Bottom 0.254: X-NORTH.135 44.33,52.32 v44.33,51.82
  Bottom 0.305: C1.1 52.27,48.89 | R1X.1 51.72,48.88 arc45 51.54,48.8 v51.37,48.64 UEP.8
N_REF  (via drill 0.25)
  Top 0.152: v4.83,37.59 4.97,37.73 arc-45 5.24,37.85 5.59,37.85 arc90 6.22,38.48 6.22,38.99 arc90 5.59,39.62 4.19,39.62 arc-90 3.56,40.26 v3.56,41.15 | v4.83,33.15 4.97,33.29 arc-45 5.24,33.4 5.59,33.4 arc90 6.22,34.04 6.22,34.54 arc90 5.59,35.18 4.19,35.18 arc-90 3.56,35.81 v3.56,36.7 | v4.83,42.04 4.97,42.18 arc-45 5.24,42.29 5.59,42.29 arc90 6.22,42.93 6.22,43.43 arc90 5.59,44.07 4.19,44.07 arc-90 3.56,44.7 v3.56,45.59
  Route15 0.152: v4.83,42.04 3.94,41.15 v3.56,41.15 | v3.56,36.7 3.67,36.7 arc45 4.12,36.89 v4.83,37.59
  Bottom 0.152: UNN.2 v3.56,41.14 v3.56,41.15 | UNN.5 4.56,37.96 arc45 4.63,37.78 v4.83,37.59 | UNE.2 v3.56,36.7 | UNE.5 4.56,33.52 arc45 4.63,33.34 v4.83,33.15 | UNW.5 4.56,42.3 v4.83,42.04 | UNW.2 v3.56,45.59 | v3.56,45.59 | U1.1 5.46,46.97 | v3.56,45.59 3.56,45.72 arc-90 3.81,45.97 4.22,45.97 arc90 4.47,46.23 U1.1 | U1.1 4.47,47.56 arc90 4.09,47.94 3.53,47.94 arc90 3.15,47.56 U1.3 | 5.46,46.97 R19.2 | 5.46,46.97 TP2.TP
N_SCK
  Bottom 0.152: X-NORTH.144 46.33,47.56 arc90 46.45,47.44 48.31,47.44 arc-45 48.76,47.25 50.11,45.91 arc45 50.55,45.72 51.05,45.72 arc-45 51.49,45.53 52.52,44.51 arc-45 52.7,44.06 52.7,42.71 arc-45 52.52,42.26 52,41.74 arc-45 51.55,41.55 U4.4
N_SCL  (via drill 0.25)
  Route2 0.152: v50.16,46.99 50.79,46.99 arc45 51.24,47.18 52.01,47.95 arc45 52.2,48.4 52.2,49.09 arc90 51.82,49.47 47.57,49.47 arc-45 47.12,49.65 46.51,50.26 arc-45 46.33,50.71 v46.33,51.31
  Bottom 0.152: v46.33,51.31 X-NORTH.143 | UEP.6 v50.16,46.99
N_SDA  (via drill 0.25)  (1 unrouted)
  Route15 0.152: 45.83,51.21 arc45 46.01,50.76 47.12,49.65 arc45 47.57,49.47 51.82,49.47 arc-90 52.2,49.09 52.2,47.76 arc-45 52.01,47.31 51.37,46.67 arc-45 50.92,46.48 v50.67,46.48
  Bottom 0.152: v45.83,52.07 X-NORTH.141 | UEP.5 v50.67,46.48
N_SDI
  Bottom 0.152: X-NORTH.140 45.33,47.31 arc45 45.44,47.05 45.62,46.86 arc45 46.07,46.67 48.06,46.67 arc-45 48.51,46.49 49.93,45.07 arc45 50.2,44.96 50.9,44.96 arc-45 51.17,44.85 51.83,44.18 arc-45 51.94,43.91 51.94,42.91 arc-45 51.83,42.64 51.67,42.48 arc-45 51.4,42.37 U4.2
N_SDO
  Bottom 0.152: X-NORTH.142 45.83,47.51 arc45 45.94,47.24 46.02,47.16 arc45 46.28,47.05 48.19,47.05 arc-45 48.64,46.87 50.02,45.49 arc45 50.38,45.34 50.97,45.34 arc-45 51.33,45.19 52.17,44.34 arc-45 52.32,43.99 52.32,42.81 arc-45 52.17,42.45 51.84,42.11 arc-45 51.48,41.96 U4.3
N_SPI_EN
  Bottom 0.152: X-NORTH.136 44.33,47.55 arc45 44.44,47.28 45.24,46.48 arc45 45.69,46.29 47.93,46.29 arc-45 48.38,46.11 49.8,44.69 arc45 50.07,44.58 50.82,44.58 arc-45 51,44.5 51.49,44.02 arc-45 51.56,43.84 51.56,42.9 arc-90 51.44,42.77 U4.1
N_SPI_V  (via drill 0.25)
  Route2 0.305: v43.94,50.29 44.12,50.29 arc-45 44.39,50.18 46.9,47.66 arc-45 47.02,47.4 v47.02,45.72
  Bottom 0.203: X-NORTH.134 43.83,50.02 arc-45 v43.94,50.29 | v47.02,45.72 47.95,45.72 arc-45 48.4,45.53 49.67,44.26 arc-45 49.84,43.87 U4.14 | C59.1 53.34,42.62 arc-45 53.27,42.45 51.81,40.99 arc-45 51.63,40.92 U4.5 U4.6
  pour Bottom: 49.53,43.05 50.55,43.05 50.55,41.27 49.53,41.27
N_VE  (via drill 0.25, 0.25 pad 0.25)
  Top 0.152: TP7.TP v8,19.94
  Route2 0.254: v10.25,36.83 10.25,37.08 arc-90 10.63,37.47 11.77,37.47 | 11.77,37.47 v11.77,36.83 | 11.77,37.47 14.44,37.47 arc90 15.07,38.1 15.07,39.74 arc45 14.89,40.19 SENSOR.F5
  Route2 0.305: v47.65,45.09 v52.7,45.09
  Route15 0.254: v11.9,45.72 11.9,44.83 arc90 12.54,44.2 14.44,44.2 arc-90 15.07,43.56 15.07,41.27 | v44.28,11.43 44.28,11.8 arc-45 44.47,12.25 45.37,13.15 arc45 45.55,13.6 45.55,17.14 | v9.36,11.43 9.36,13.07 arc-45 9.55,13.52 9.81,13.78 arc45 10,14.23 10,17.14 | v15.2,20.32 15.2,18.41
  Bottom 0.152: U6.13 v49.43,36.58 49.1,36.91 arc-45 49.02,37.09 C67.1 | C85.1 v46.23,35.95
  Bottom 0.203: X-NORTH.115 v39.33,54.61 | X-NORTH.127 v42.33,54.61 | X-NORTH.109 v37.83,54.61 | X-NORTH.121 v40.83,54.61 | X-NORTH.133 v43.83,54.61 | U4.13 49.43,43.77 arc45 49.35,43.95 48.21,45.09 v47.65,45.09 | C69.1 v54.1,42.8 54.1,42.67 51.92,40.49 arc45 51.84,40.31 U5.13 51.84,39.99 | 52.76,45.03 v52.7,45.09
  Bottom 0.254: C53.1 11.39,18.45 arc45 11.5,18.18 SENSOR.D3 | C54.1 SENSOR.D26 40.38,18.5 arc-45 40.35,18.59 C75.1 | C55.1 41.87,18.59 arc-45 41.84,18.5 41.78,18.45 arc45 41.74,18.36 41.74,17.14 SENSOR.C26 | C56.1 42.89,18.59 arc45 42.92,18.5 arc-45 43.02,18.29 43.02,17.41 arc-45 42.83,16.96 SENSOR.C27 | SENSOR.F5 13.99,40.19 arc45 13.8,39.74 13.8,39.09 arc45 13.88,38.91 13.98,38.81 arc-45 14.06,38.63 C50.1 C84.1 | SENSOR.E26 41.18,39.3 arc-45 41.36,38.85 C52.1 C76.1 | C51.1 40.6,38.53 arc45 40.55,38.66 arc-45 40.48,38.84 40.48,39.74 arc-45 40.66,40.19 SENSOR.F26 | C93.1 v52.7,45.09 | C23.1 v9.36,11.43 | C26.1 v9.36,20.32 | C25.1 v15.2,20.32 | C24.1 v44.28,11.43 | C28.1 v11.9,45.72 | C27.1 v11.77,36.83 | C22.1 v10.25,36.83
  Bottom 0.406: C77.1 6.58,18.41 arc90 6.96,18.8 C86.1
  Bottom 0.508: C86.1 v8,19.94 | v5.97,20.45 6.98,20.45 | v5.97,19.43 6.98,19.43
  pour Route15: 9.91,19.42 9.91,20.32 arc90 9.4,20.83 6.1,20.83 arc90 5.59,20.32 5.59,19.56 arc90 6.1,19.05 6.86,19.05 arc-90 7.49,18.41 7.49,17.14 arc90 8.13,16.5 48.48,16.5 arc90 49.11,17.14 49.11,23.62 arc-90 49.75,24.26 55.25,24.26 arc90 55.88,24.89 55.88,54.86 54.86,55.88 37.72,55.88 arc90 37.34,55.5 37.34,54.61 arc90 37.72,54.23 51.23,54.23 arc146 54.61,51.44 54.61,46.22 arc-90 53.97,45.59 52.7,45.59 arc90 52.07,44.95 52.07,42.28 arc-90 51.44,41.65 14.44,41.65 arc90 13.93,41.14 13.93,39.87 arc90 14.44,39.36 50.16,39.36 arc-90 50.8,38.73 50.8,37.47 arc-90 50.16,36.83 46.23,36.83 arc90 45.72,36.32 45.72,34.8 arc90 46.23,34.29 53.97,34.29 arc-90 54.61,33.66 54.61,26.42 arc-90 53.97,25.78 48.09,25.78 arc90 47.46,25.15 47.46,19.42 arc-90 46.83,18.79 10.54,18.79 arc-90
N_VE_CV  (via drill 0.25)
  Route15 0.152: v7.24,45.97 6.92,45.65 arc45 6.73,45.2 6.73,37.49 arc45 6.92,37.04 v7.26,36.7
  Bottom 0.152: X-NORTH.6 11.82,47.39 arc-45 11.64,46.95 11.23,46.54 arc-45 10.79,46.36 7.88,46.36 arc45 7.43,46.17 v7.24,45.97 | R7.1 C10.1 v7.26,36.7
N_VE_OV  (via drill 0.25)
  Route15 0.152: v3.56,33.15 3.56,34.79 arc-45 3.74,35.24 5.15,36.64 arc45 5.33,37.09 5.33,37.46 arc45 5.15,37.91 4.88,38.17 arc-45 4.7,38.62 4.7,39.87 arc-45 4.88,40.32 5.53,40.96 arc45 5.71,41.41 5.71,42.03 arc45 5.53,42.48 5.01,42.99 arc-45 4.83,43.44 4.83,44.19 arc-45 5.01,44.64 5.4,45.03 arc45 5.59,45.47 5.59,47.11 arc-45 5.77,47.56 6.8,48.58 arc-45 7.25,48.77 10.79,48.77 arc45 11.23,48.95 11.64,49.36 arc45 11.82,49.81 v11.82,50.29
  Bottom 0.152: UNE.7 v3.56,33.15
  Bottom 0.203: X-NORTH.5 v11.82,50.29
N_VE_UV  (via drill 0.25)
  Route2 0.152: v2.92,36.7 3.24,36.38 arc45 3.69,36.2 4.44,36.2 arc45 4.88,36.38 5.15,36.64 arc45 5.33,37.09 5.33,37.46 arc45 5.15,37.91 4.88,38.17 arc-45 4.7,38.62 4.7,39.87 arc-45 4.88,40.32 5.53,40.96 arc45 5.71,41.41 5.71,42.03 arc45 5.53,42.48 5.01,42.99 arc-45 4.83,43.44 4.83,44.19 arc-45 5.01,44.64 5.4,45.03 arc45 5.59,45.47 5.59,47.11 arc-45 5.77,47.56 6.8,48.58 arc-45 7.25,48.77 12.31,48.77 arc45 12.76,48.95 13.14,49.33 arc45 13.32,49.78 v13.32,51.31
  Bottom 0.152: UNE.1 3.06,36.46 arc45 2.99,36.64 v2.92,36.7
  Bottom 0.203: X-NORTH.11 v13.32,51.31
N_VN  (via drill 0.25)
  Top 0.152: TP5.TP v8,11.18
  Route2 0.254: SENSOR.E1 9.81,39.82 arc-45 10.26,40 11.9,40 arc90 12.54,40.64 12.54,41.91 arc-90 13.17,42.55 14.44,42.55